# Altium project ANALOG SIGNAL DEV-BOARD.PrjPcb
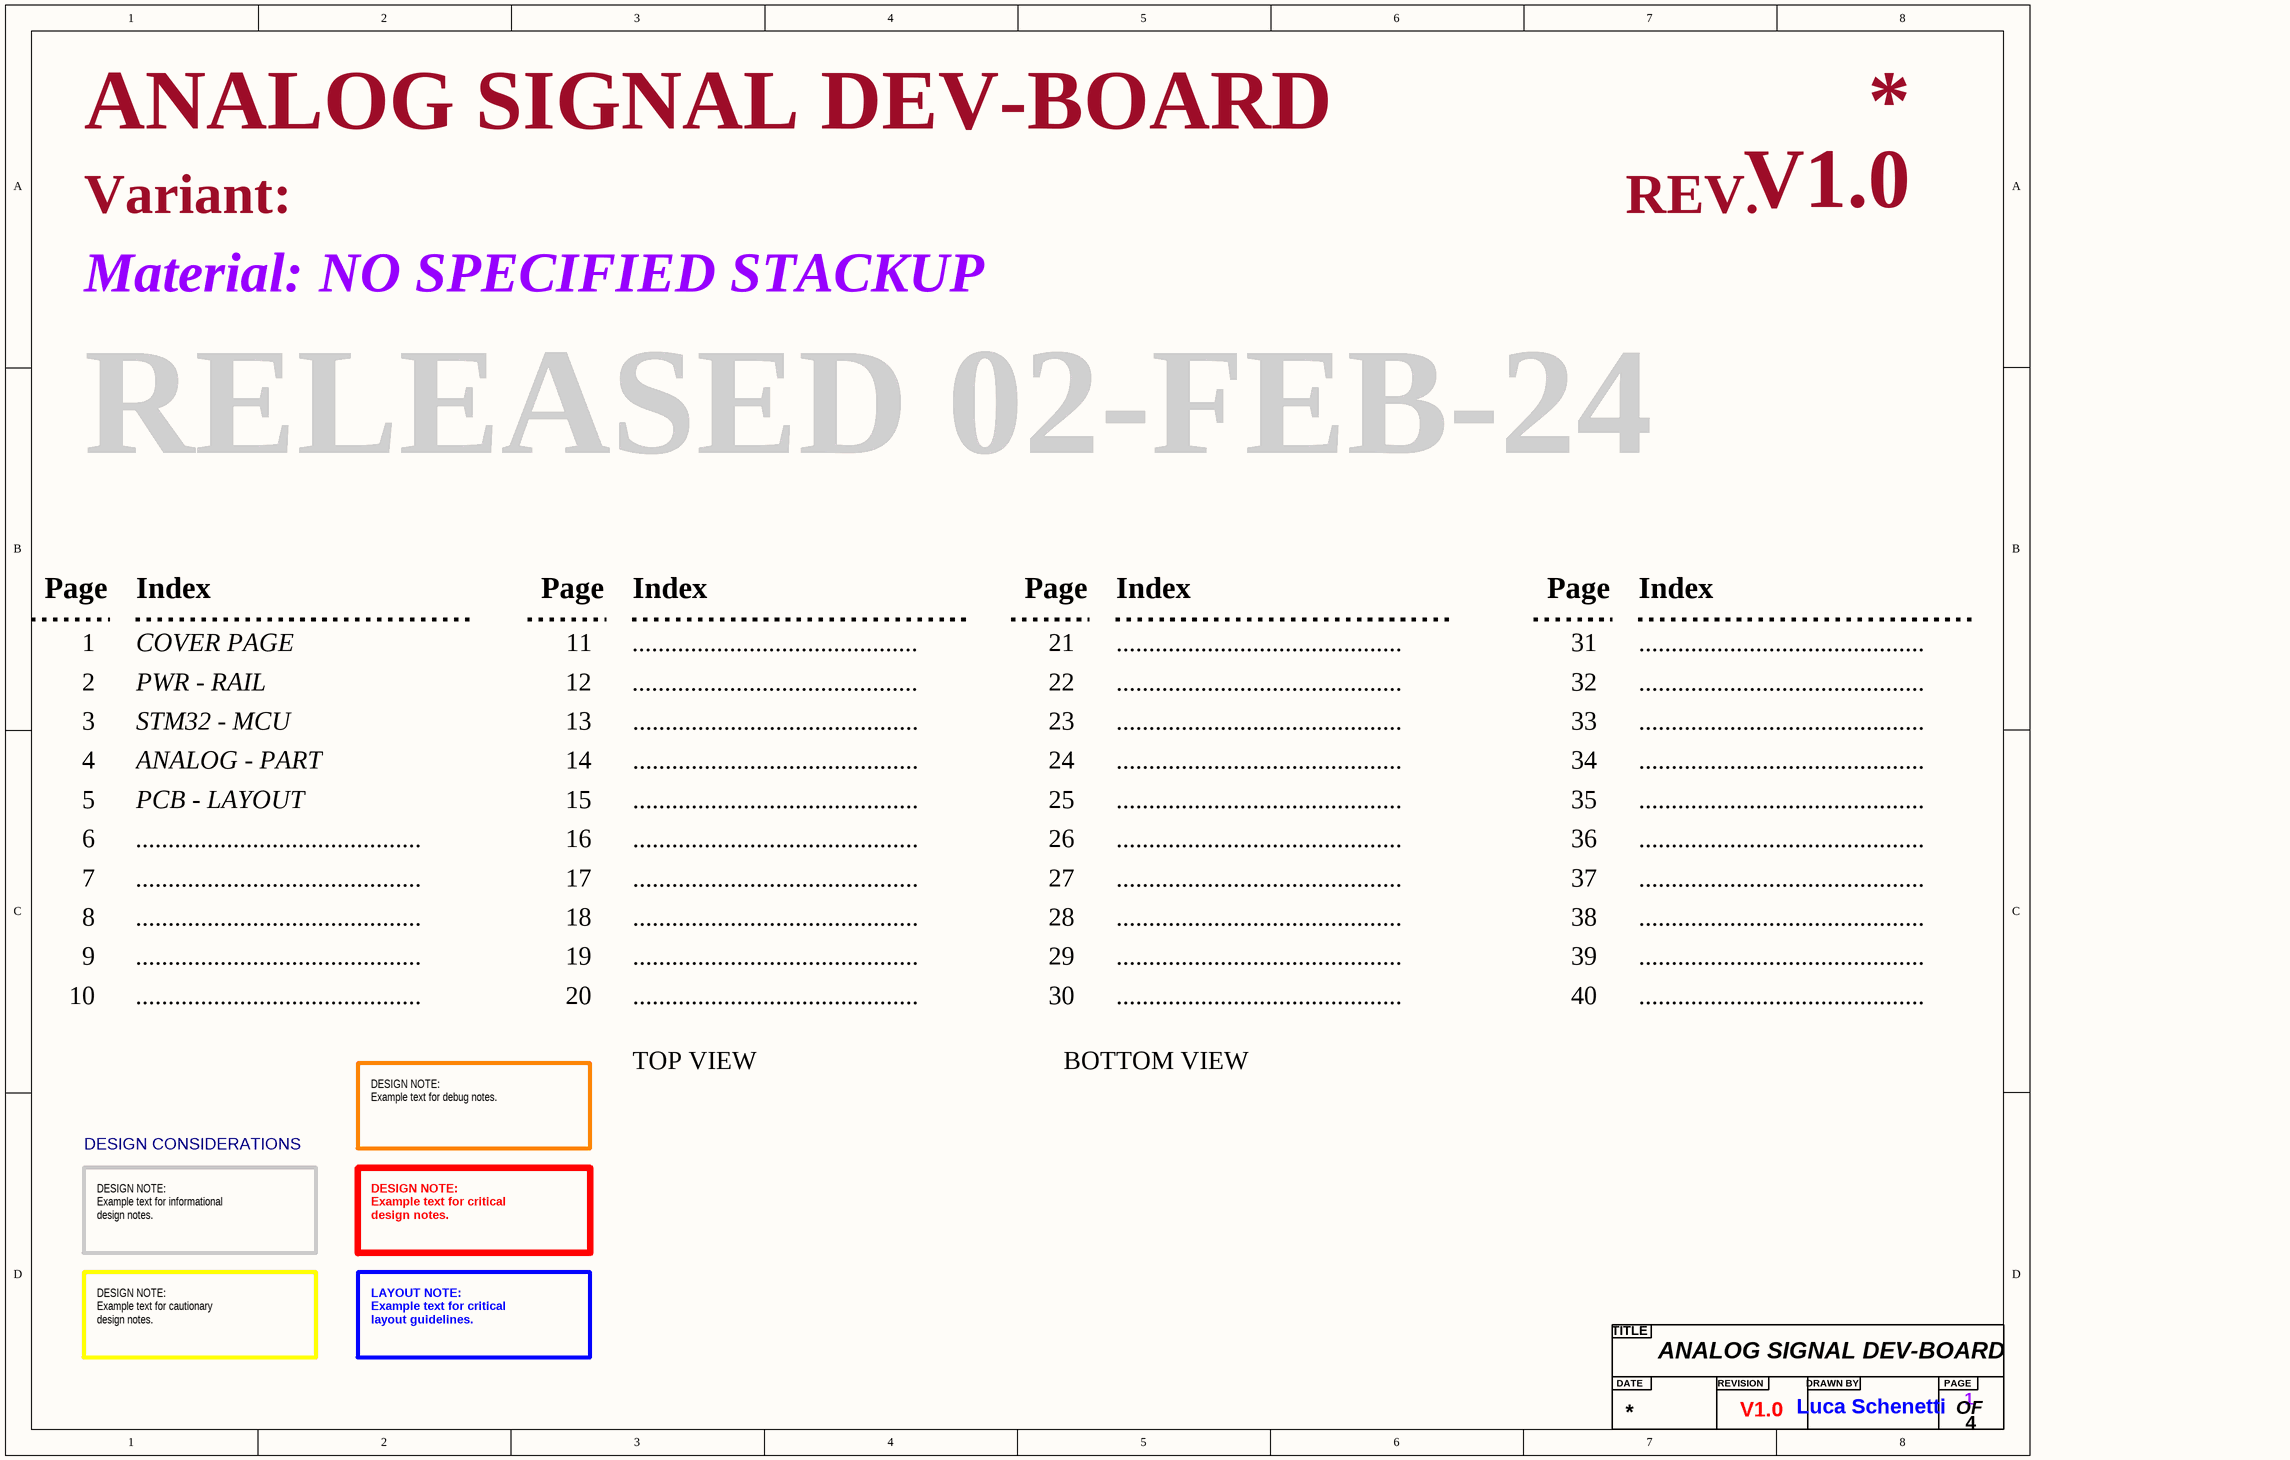
[diagram p0: COVER PAGE.SchDoc]
4 sheets, 282 parts. Net scope: flat (ports and power ports of the same name join across sheets).
Board file: PCB-LAYOUT.PcbDoc
Sheets:
  COVER PAGE.SchDoc
  PWR-RAIL.SchDoc
  STM32-MCU.SchDoc
  ANALOG-PART.SchDoc

## Sheet COVER PAGE.SchDoc: ANALOG SIGNAL DEV-BOARD
size A3; Author: Luca Schenetti; DrawnBy: Luca Schenetti; Engineer: Luca Schenetti; Revision: V1.0; SheetNumber: 1; SheetTotal: 4; Material: NO SPECIFIED STACKUP

### Parts
(Parts that share a designator on the sheet are numbered #1, #2 ... from top to bottom, then left to right.)
?#1  Title  (value not drawn)  (graphical)

### Notes on the sheet
- Variant:
- REV.
- Material:
- RELEASED 02-FEB-24
- Page
- Index
- 1
- 2
- COVER PAGE
- PWR - RAIL
- 11
- 12
- ............................................
- 21
- 22
- 31
- 32
- 3
- STM32 - MCU
- 13
- 23
- 33
- 4
- 5
- ANALOG - PART
- PCB - LAYOUT
- 14
- 15
- 24
- 25
- 34
- 35
- 6
- 7
- 16
- 17
- 26
- 27
- 36
- 37
- 8
- 18
- 28
- 38
- 9
- 10
- 19
- 20
- 29
- 30
- 39
- 40
- TOP VIEW
- BOTTOM VIEW
- DESIGN CONSIDERATIONS
- DESIGN NOTE:
  Example text for debug notes.
- DESIGN NOTE:
  Example text for informational
  design notes.
- DESIGN NOTE:
  Example text for critical
  design notes.
- DESIGN NOTE:
  Example text for cautionary
  design notes.
- LAYOUT NOTE:
  Example text for critical
  layout guidelines.
- (in symbol Title) TITLE; DATE; REVISION; DRAWN BY; PAGE; OF

## Sheet PWR-RAIL.SchDoc: ANALOG SIGNAL DEV-BOARD
size A2; DrawnBy: Luca Schenetti; Revision: V1.0; SheetNumber: 2; SheetTotal: 4
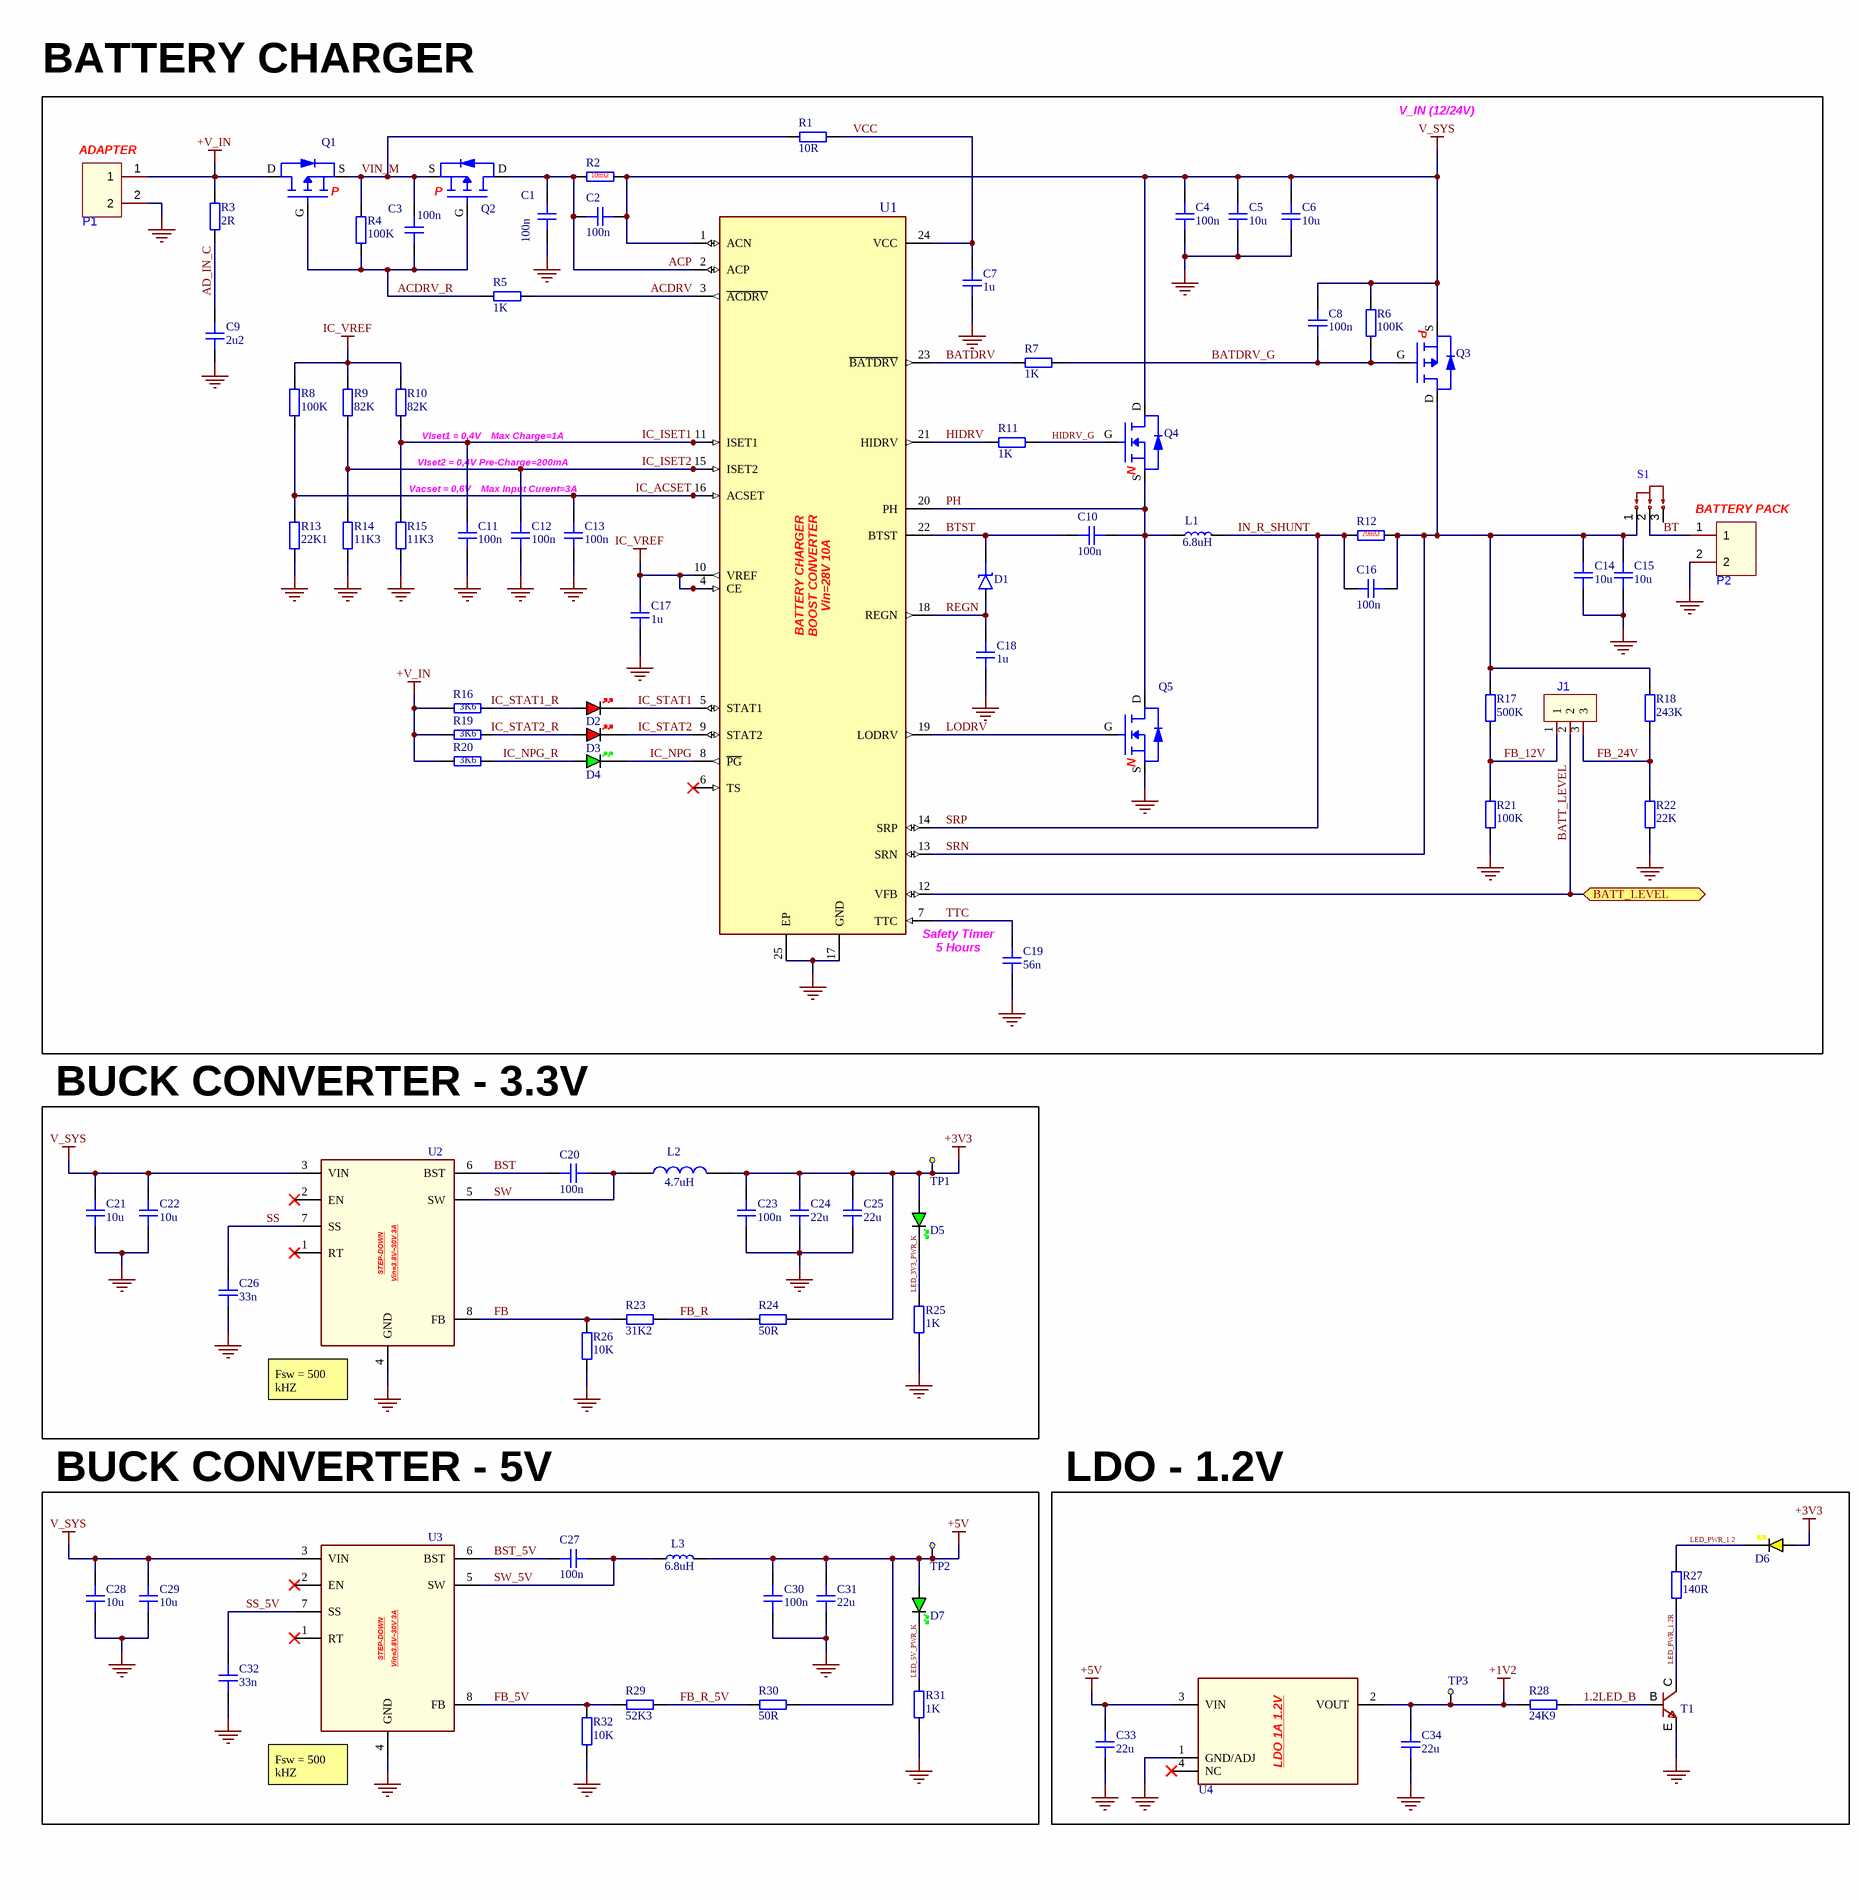
[diagram p1: PWR-RAIL.SchDoc, left]
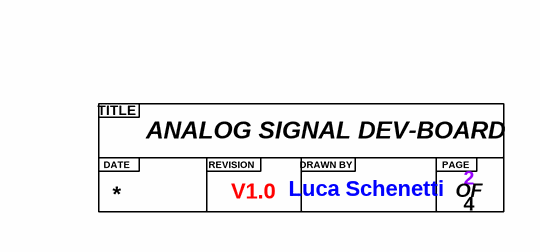
[diagram p2: PWR-RAIL.SchDoc, right]

### Parts
(Parts that share a designator on the sheet are numbered #1, #2 ... from top to bottom, then left to right.)
?#2  Title  (value not drawn)  (graphical)
C1  100n  [CAP_0603]
C2  100n  [CAP_0603]
C3  100n  [CAP_0603]
C4  100n  [CAP_0603]
C5  10u  [CAP_0805]
C6  10u  [CAP_0805]
C7  1u  [CAP_0603]
C8  100n  [CAP_0603]
C9  2u2  [CAP_0603]
C10  100n  [CAP_0603]
C11  100n  [CAP_0603]
C12  100n  [CAP_0603]
C13  100n  [CAP_0603]
C14  10u  [CAP_0805]
C15  10u  [CAP_0805]
C16  100n  [CAP_0603]
C17  1u  [CAP_0603]
C18  1u  [CAP_0603]
C19  56n  [CAP_0603]
C20  100n  [CAP_0603]
C21  10u  [CAP_0805]
C22  10u  [CAP_0805]
C23  100n  [CAP_0603]
C24  22u  [CAP_0603]
C25  22u  [CAP_0603]
C26  33n  [CAP_0603]
C27  100n  [CAP_0603]
C28  10u  [CAP_0805]
C29  10u  [CAP_0805]
C30  100n  [CAP_0603]
C31  22u  [CAP_0603]
C32  33n  [CAP_0603]
C33  22u  [CAP_1206]
C34  22u  [CAP_1206]
D1  Diode Schottky  [RB521S30T1G]  (value not drawn)
D2  RED  [LED_0603_RED]  (value not drawn)
D3  RED  [LED_0603_RED]  (value not drawn)
D4  GREEN  [LED_0603_GREEN]  (value not drawn)
D5  GREEN  [LED_0603_GREEN]  (value not drawn)
D6  YELLOW  [LED_0603_YELLOW]  (value not drawn)
D7  GREEN  [LED_0603_GREEN]  (value not drawn)
J1  2.54mm 3P  [2.54mm 3P]  (value not drawn)
L1  6.8uH  [FXL0530-6R8-M]
L2  4.7uH  [FXL0530-4R7-M]
L3  6.8uH  [SMMS0420-6R8M]
P1  WJ500V-5.08-2P  [CONN-TH_2P-P5.00_WJ500V-5.08-2P]  (value not drawn)
P2  WJ500V-5.08-2P  [CONN-TH_2P-P5.00_WJ500V-5.08-2P]  (value not drawn)
Q1  P-Channel VDS=-30V  [SI7617DN-T1-GE3]  (value not drawn)
Q2  P-Channel VDS=-30V  [SI7617DN-T1-GE3]  (value not drawn)
Q3  P-Channel VDS=-30V  [SI7617DN-T1-GE3]  (value not drawn)
Q4  N-Channel Vgs=30V 12A  [SIS412DN-T1-GE3]  (value not drawn)
Q5  N-Channel Vgs=30V 12A  [SIS412DN-T1-GE3]  (value not drawn)
R1  10R  [RES_1206]
R2  10mΩ  [RES_1206]
R3  2R  [RES_2010]
R4  100K  [RES_0603]
R5  1K  [RES_0603]
R6  100K  [RES_0603]
R7  1K  [RES_0603]
R8  100K  [RES_0603]
R9  82K  [RES_0603]
R10  82K  [RES_0603]
R11  1K  [RES_0603]
R12  20mΩ  [RES_1206]
R13  22K1  [RES_0603]
R14  11K3  [RES_0603]
R15  11K3  [RES_0603]
R16  3K6  [RES_0603]
R17  500K  [RES_0603]
R18  243K  [RES_0603]
R19  3K6  [RES_0603]
R20  3K6  [RES_0603]
R21  100K  [RES_0603]
R22  22K  [RES_0603]
R23  31K2  [RES_0603]
R24  50R  [RES_0603]
R25  1K  [RES_0402]
R26  10K  [RES_0603]
R27  140R  [RES_0402]
R28  24K9  [RES_0402]
R29  52K3  [RES_0603]
R30  50R  [RES_0603]
R31  1K  [RES_0402]
R32  10K  [RES_0603]
S1  3 POS SWITCH LATERAL MOUNT  [HX SS12D10G4-WJ]  (value not drawn)
T1  40V NPN IC = 1A  [MMBT3904]  (value not drawn)
TP1  Test Point  [Test Point]  (value not drawn)
TP2  Test Point  [Test Point]  (value not drawn)
TP3  Test Point  [Test Point]  (value not drawn)
U1  Battery Charger 1S-7S Buck-Boost Converter Li-Ion  [BQ24610RGER]  (value not drawn)
U2  Step Down Converter 3A 3.8V~30V  [TPS62933DRLR]  (value not drawn)
U3  Step Down Converter 3A 3.8V~30V  [TPS62933DRLR]  (value not drawn)
U4  LDO 1A 1.2V  [AMS1117-1.2]  (value not drawn)

### Blocks framed on the sheet
BATTERY CHARGER: C1-C19 D1-D4 J1 L1 P1 P2 Q1-Q5 R1-R22 S1 U1
BUCK CONVERTER - 3.3V: C20-C26 D5 L2 R23-R26 TP1 U2
BUCK CONVERTER - 5V: C27-C32 D7 L3 R29-R32 TP2 U3
LDO - 1.2V: C33 C34 D6 R27 R28 T1 TP3 U4

### Ports
BATT_LEVEL (bidir, see STM32-MCU[3C])

### Nets
+1V2: C34.2 R28.2 TP3.1(Test_Point) U4.2(VOUT)
+3V3: C23.1 C24.2 C25.2 D5.A D6.A L2.2 R24.1 TP1.1(Test_Point)
+5V: C30.1 C31.2 C33.2 D7.A L3.2 R30.1 TP2.1(Test_Point) U4.3(VIN)
+V_IN: P1.1 Q1.D R3.2 R16.1 R19.1 R20.1
GND: C1.2 C4.2 C5.1 C6.1 C7.2 C9.1 C11.1 C12.1 C13.1 C14.1 C15.1 C17.2 C18.2 C19.1 C21.1 C22.1 C23.2 C24.1 C25.1 C26.2 C28.1 C29.1 C30.2 C31.1 C32.2 C33.1 C34.1 P1.2 P2.2 Q5.S R13.1 R14.1 R15.1 R21.2 R22.2 R25.1 R26.1 R31.1 R32.1 T1.E U1.17(GND) U1.25(EP) U2.4(GND) U3.4(GND) U4.1(GND/ADJ)
IC_VREF: C17.1 R8.2 R9.2 R10.2 U1.4(CE) U1.10(VREF)
V_SYS: C2.1 C4.1 C5.2 C6.2 C8.1 C21.2 C22.2 C28.2 C29.2 Q3.S Q4.D R2.2 R6.1 U1.1(ACN) U2.3(VIN) U3.3(VIN)
1.2LED_B: R28.1 T1.B
ACDRV: R5.1 U1.3(~{ACDRV})
ACDRV_R: C3.2 Q1.G Q2.G R4.2 R5.2
ACP: C1.1 C2.2 Q2.D R2.1 U1.2(ACP)
AD_IN_C: C9.2 R3.1
BATDRV: R7.2 U1.23(~{BATDRV})
BATDRV_G: C8.2 Q3.G R6.2 R7.1
BATT_LEVEL: J1.2 U1.12(VFB) ; port BATT_LEVEL
BST: C20.2 U2.6(BST)
BST_5V: C27.2 U3.6(BST)
BT: P2.1 S1.2
BTST: C10.1 D1.K U1.22(BTST)
FB: R23.2 R26.2 U2.8(FB)
FB_5V: R29.2 R32.2 U3.8(FB)
FB_12V: J1.1 R17.2 R21.1
FB_24V: J1.3 R18.2 R22.1
FB_R: R23.1 R24.2
FB_R_5V: R29.1 R30.2
HIDRV: R11.2 U1.21(HIDRV)
HIDRV_G: Q4.G R11.1
IC_ACSET: C13.2 R8.1 R13.2 U1.16(ACSET)
IC_ISET1: C11.2 R10.1 R15.2 U1.11(ISET1)
IC_ISET2: C12.2 R9.1 R14.2 U1.15(ISET2)
IC_NPG: D4.K U1.8(~{PG})
IC_NPG_R: D4.A R20.2
IC_STAT1: D2.K U1.5(STAT1)
IC_STAT1_R: D2.A R16.2
IC_STAT2: D3.K U1.9(STAT2)
IC_STAT2_R: D3.A R19.2
IN_R_SHUNT: C16.1 L1.2 R12.1 U1.14(SRP)  [also labelled SRP]
LED_3V3_PWR_K: D5.K R25.2
LED_5V_PWR_K: D7.K R31.2
LED_PWR_1.2: D6.K R27.2
LED_PWR_1.2R: R27.1 T1.C
LODRV: Q5.G U1.19(LODRV)
PH: C10.2 L1.1 Q4.S Q5.D U1.20(PH)
REGN: C18.1 D1.A U1.18(REGN)
SRN: C14.2 C15.2 C16.2 Q3.D R12.2 R17.1 R18.1 S1.1 U1.13(SRN)
SS: C26.1 U2.7(SS)
SS_5V: C32.1 U3.7(SS)
SW: C20.1 L2.1 U2.5(SW)
SW_5V: C27.1 L3.1 U3.5(SW)
TTC: C19.2 U1.7(TTC)
VCC: C7.1 R1.2 U1.24(VCC)
VIN_M: C3.1 Q1.S Q2.S R1.1 R4.1

Not connected (* = marked no-connect by the designer): S1 3; U1 6(TS)*; U2 1(RT)* 2(EN)*; U3 1(RT)* 2(EN)*; U4 4(NC)*

### Notes on the sheet
- (near P1) ADAPTER
- V_IN (12/24V)
- (near R10) VIset1 = 0,4V    Max Charge=1A
- VIset2 = 0,4V Pre-Charge=200mA
- Vacset = 0,6V    Max Input Curent=3A
- (near P2) BATTERY PACK
- Safety Timer
- 5 Hours
- (near U2) Fsw = 500 kHZ
- (near U3) Fsw = 500 kHZ
- (in symbol BQ24610RGER) BATTERY CHARGER; BOOST CONVERTER; Vin=28V 10A
- (in symbol SI7617DN-T1-GE3) P
- (in symbol SIS412DN-T1-GE3) N
- (in symbol Title) TITLE; DATE; REVISION; DRAWN BY; PAGE; OF
- (in symbol TPS62933DRLR) STEP-DOWN; Vin=3.8V~30V 3A

### Library data of the parts
C1-C4 C8 C10-C13 C16 C20 C23 C27 C30 = CAP_0603: Capacitor SMD 0603 [C14663]; Manufacturer: *; Manufacturer Part Number: *; Distributor Link: *; LCSC: *; Rating: *; Dielectric: *
C5 C6 C14 C15 C21 C22 C28 C29 = CAP_0805: Capacitor SMD 0805[C440198]; Manufacturer: *; Manufacturer Part Number: *; Distributor Link: *; LCSC: *; Rating: *; Dielectric: *
C7 C17 C18 = CAP_0603: Capacitor SMD 0603 [C15849]; Manufacturer: *; Manufacturer Part Number: *; Distributor Link: *; LCSC: *; Rating: *; Dielectric: *
C9 = CAP_0603: [C913904]; Manufacturer: *; Manufacturer Part Number: *; Distributor Link: *; LCSC: *; Rating: *; Dielectric: *
C19 = CAP_0603: [C282072]; Manufacturer: *; Manufacturer Part Number: *; Distributor Link: *; LCSC: *; Rating: *; Dielectric: *
C24 C25 C31 = CAP_0603: Capacitor SMD 0603 [C60077]; Manufacturer: *; Manufacturer Part Number: *; Distributor Link: *; LCSC: *; Rating: *; Dielectric: *
C26 C32 = CAP_0603: [C21117]; Manufacturer: *; Manufacturer Part Number: *; Distributor Link: *; LCSC: *; Rating: *; Dielectric: *
C33 C34 = CAP_1206: [C12891]; Manufacturer: *; Manufacturer Part Number: *; Distributor Link: *; LCSC: *; Rating: *; Dielectric: *
D1 = RB521S30T1G: [C145179]
D2 D3 = LED_0603_RED: [C2926776]
D4 = LED_0603_GREEN: [C2986059]
D5 D7 = LED_0603_GREEN: LED 0603 GREEN SMD[C2986059]
D6 = LED_0603_YELLOW: LED 0603 YELLOW SMD[C72038]
J1 = 2.54mm 3P: [C6332196]; Manufacturer: HANBO(汉博); Symbol: HB-PH3-25413PB2GOP; Add into BOM: yes; Pin Structure: 1x3P; Circluar Pins/Square Pins: Square Pins; Current Rating (Max): 3A; Voltage Rating (Max): 250V; Soldering Temperature(Max): 260℃; Device: HB-PH3-25413PB2GOP; LCSC Part Name: 间距:2.54mm 1x3P 直插 方针; Supplier Part: C6332196; Manufacturer Part: HB-PH3-25413PB2GOP; Supplier Footprint: 插件,P=2.54mm; JLCPCB Part Class: Extended Part; Datasheet: https://atta.szlcsc.com/upload/public/pdf/source/20230803/F72D259687963761DF1B552F3BB84A31.pdf; Supplier: LCSC; Convert to PCB: yes; Pitch: 2.54mm; Row Spacing: 2.54mm; Mounting Type: Straight; Number of Rows: Plugin; Number of Pins: 3P; Length of Mating Pin: 6mm; Insulation Height: 2.54mm; Length of End Connection Pin: 3mm; Contact Plating: Gold; Operating Temperature Range: -40℃~+105℃; Color: Black
L1 = FXL0530-6R8-M: [C177249]
L2 = FXL0530-4R7-M: [C177246]
L3 = SMMS0420-6R8M: [C133194]
P1 P2 = WJ500V-5.08-2P: [C8465]; Manufacturer: KANGNEX(康奈克斯电气); Symbol: WJ500V-5.08-2P-14-00A; Add into BOM: yes; Structure: 1x2P; Pitch: 5.08mm; Current Rating (Max): 18A; Voltage Rating (Max): 250V; Wire Gauge - AWG: 14~30; Wire Gauge - mm2: 2.5; Number of PINs Per Row: 2; Screw Specification: M2.5; Device: WJ500V-5.08-2P; LCSC Part Name: 1x2P 5.08mm 直插 排数:1 每排P数:2; Supplier Part: C8465; Manufacturer Part: WJ500V-5.08-2P; Supplier Footprint: 插件,P=5.08mm; JLCPCB Part Class: Extended Part; Datasheet: https://atta.szlcsc.com/upload/public/pdf/source/20191225/C8465_02D34CE5B5B4A53DF5891601D97FA9F4.pdf; Supplier: LCSC; Convert to PCB: yes; Color: Green; Mounting Style: Straight; Number of Pins: 2P; Number of Rows: 1; Contact Material: -; Contact Plating: -; Operating Temperature Range: -40℃~+105℃; Soldering Temperature(Max): -
Q1-Q3 = SI7617DN-T1-GE3: [C727607]
Q4 Q5 = SIS412DN-T1-GE3: [C111309]
R1 = RES_1206: [C17903]; Manufacturer: *; Manufacturer Part Number: *; Distributor Link: *; LCSC: *
R2 = RES_1206: [C105362]; Manufacturer: *; Manufacturer Part Number: *; Distributor Link: *; LCSC: *
R3 = RES_2010: [C2960923]
R4 R6 R8 R21 = RES_0603: [C25803]; Manufacturer: *; Manufacturer Part Number: *; Distributor Link: *; LCSC: *
R5 R7 R11 = RES_0603: [C21190]; Manufacturer: *; Manufacturer Part Number: *; Distributor Link: *; LCSC: *
R9 R10 = RES_0603: [C23254]; Manufacturer: *; Manufacturer Part Number: *; Distributor Link: *; LCSC: *
R12 = RES_1206: [C7420010]; Manufacturer: *; Manufacturer Part Number: *; Distributor Link: *; LCSC: *
R13 = RES_0603: [C25961]; Manufacturer: *; Manufacturer Part Number: *; Distributor Link: *; LCSC: *
R14 R15 = RES_0603: [C22860]; Manufacturer: *; Manufacturer Part Number: *; Distributor Link: *; LCSC: *
R16 R19 R20 = RES_0603: [C22980]; Manufacturer: *; Manufacturer Part Number: *; Distributor Link: *; LCSC: *
R17 = RES_0603: [C2902631]; Manufacturer: *; Manufacturer Part Number: *; Distributor Link: *; LCSC: *
R18 = RES_0603: [C23351]; Manufacturer: *; Manufacturer Part Number: *; Distributor Link: *; LCSC: *
R22 = RES_0603: [C31850]; Manufacturer: *; Manufacturer Part Number: *; Distributor Link: *; LCSC: *
R23 = RES_0603: [C863036]; Manufacturer: *; Manufacturer Part Number: *; Distributor Link: *; LCSC: *
R24 R30 = RES_0603: [C849792]; Manufacturer: *; Manufacturer Part Number: *; Distributor Link: *; LCSC: *
R25 R31 = RES_0402: Resistor SMD 0402 [C11702]; Manufacturer: *; Manufacturer Part Number: *; Distributor Link: *; LCSC: *
R26 R32 = RES_0603: [C25804]; Manufacturer: *; Manufacturer Part Number: *; Distributor Link: *; LCSC: *
R27 = RES_0402: [C138056]; Manufacturer: *; Manufacturer Part Number: *; Distributor Link: *; LCSC: *
R28 = RES_0402: [C25874]; Manufacturer: *; Manufacturer Part Number: *; Distributor Link: *; LCSC: *
R29 = RES_0603: [C23198]; Manufacturer: *; Manufacturer Part Number: *; Distributor Link: *; LCSC: *
S1 = HX SS12D10G4-WJ: [C19189123]; Manufacturer: hanxia(韩下); Add into BOM: yes; Circuit: SPDT; Switch Length: 12.7mm; Switch Width: 6.7mm; Switch Height: 6.4mm; Current Rating (DC): 2A; Voltage Rating (DC): 125V; Mechanical Life: 3千次; Symbol: HX SS12D10G4-WJ; Device: HX SS12D10G4-WJ; LCSC Part Name: 两档卧式插件 3脚拨动开关弯插 柄长4.0mm; Supplier Part: C19189123; Manufacturer Part: HX SS12D10G4-WJ; Supplier Footprint: 插件-3P,6.7x12.7mm; JLCPCB Part Class: Extended Part; Datasheet: https://atta.szlcsc.com/upload/public/pdf/source/20231103/079DBC80FFF3B72C7ED19D92AC75D426.pdf; Supplier: LCSC; Convert to PCB: yes; Operating Temperature: -25℃~+70℃
T1 = MMBT3904: [C20526]
U1 = BQ24610RGER: [C19384]
U2 U3 = TPS62933DRLR: [C3200405]
U4 = AMS1117-1.2: [C347218]
TP1-TP3 = Test Point: Value: Test Point

## Sheet STM32-MCU.SchDoc: ANALOG SIGNAL DEV-BOARD
size A1; DrawnBy: Luca Schenetti; Revision: V1.0; SheetNumber: 3; SheetTotal: 4
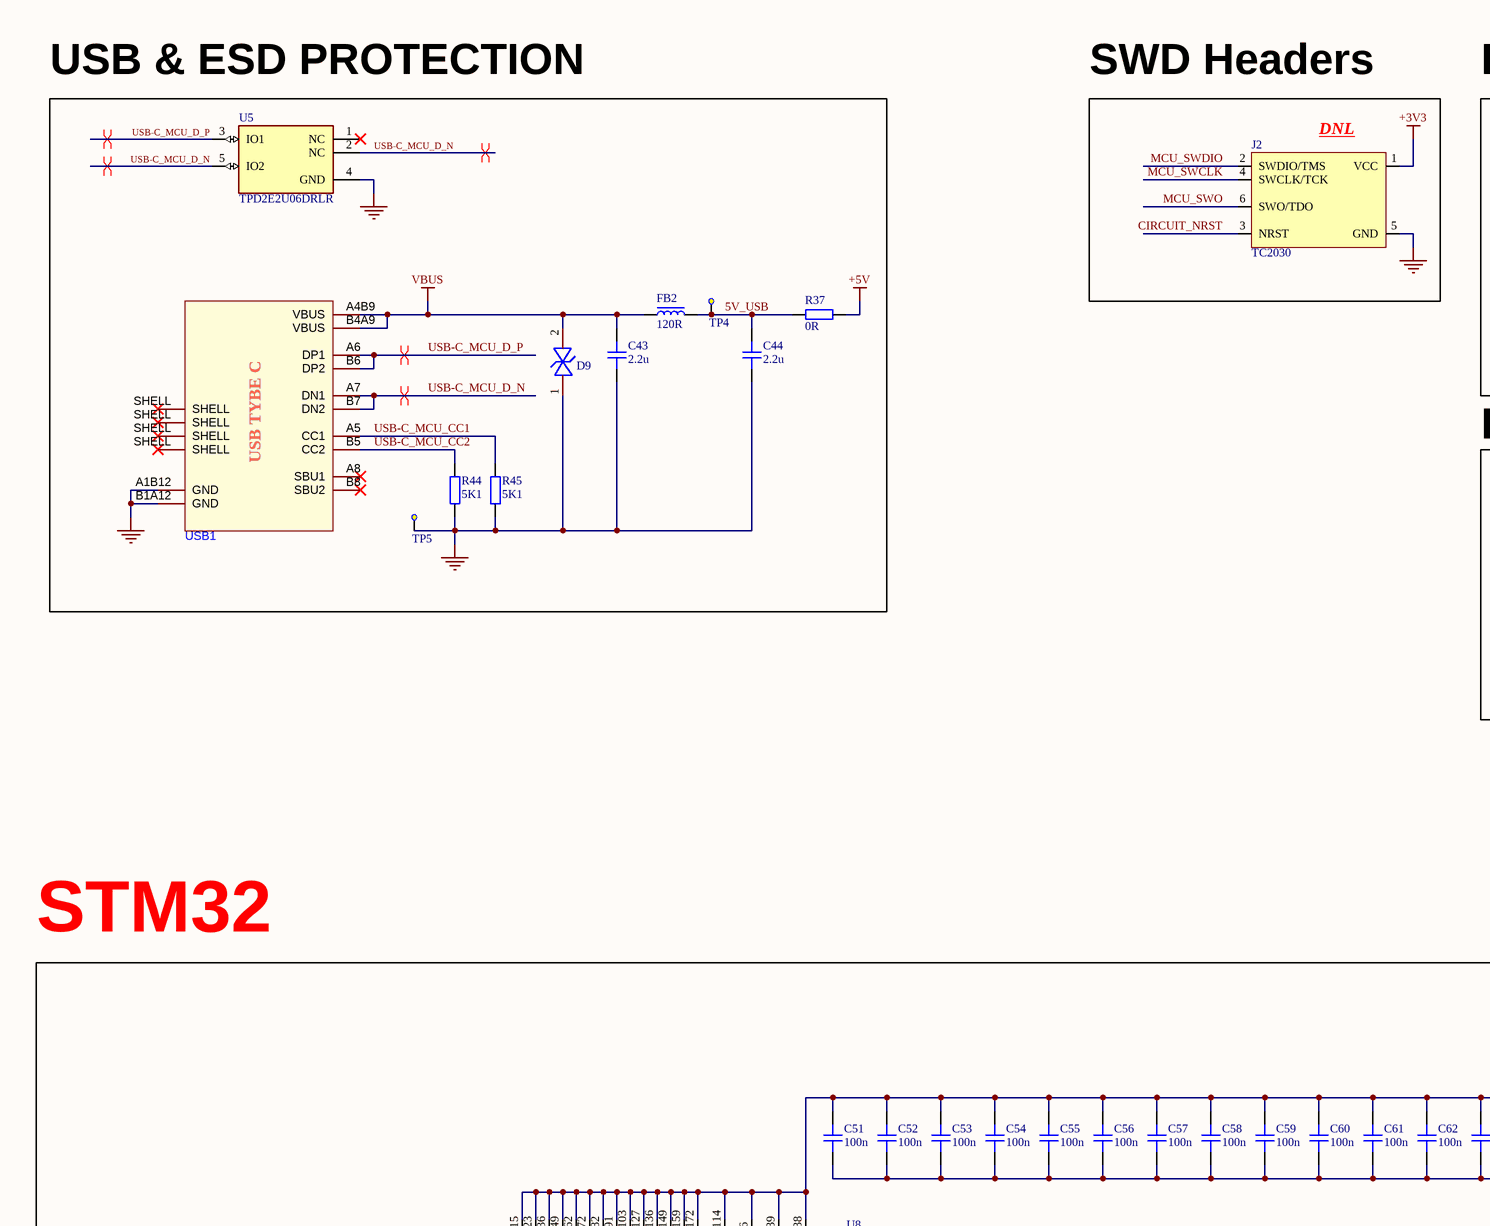
[diagram p3: STM32-MCU.SchDoc, top left]
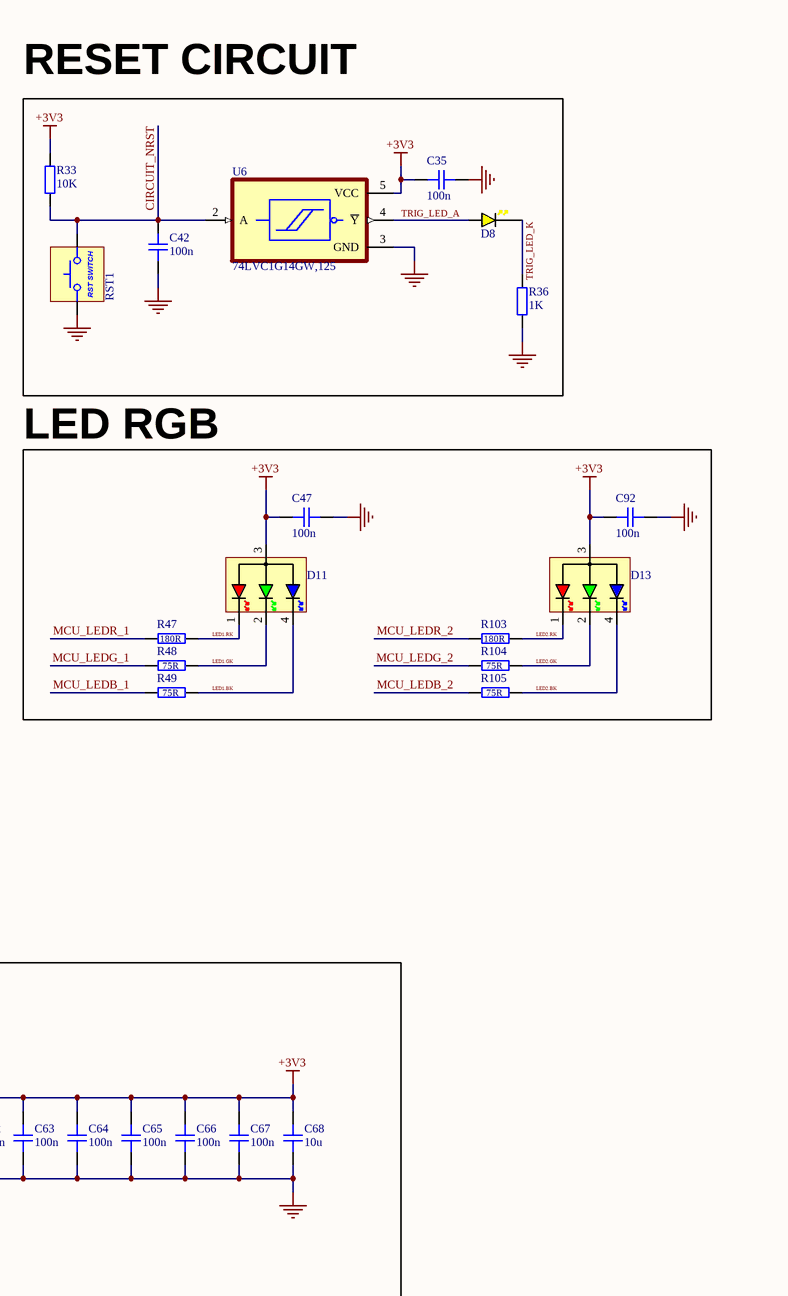
[diagram p4: STM32-MCU.SchDoc, top middle]
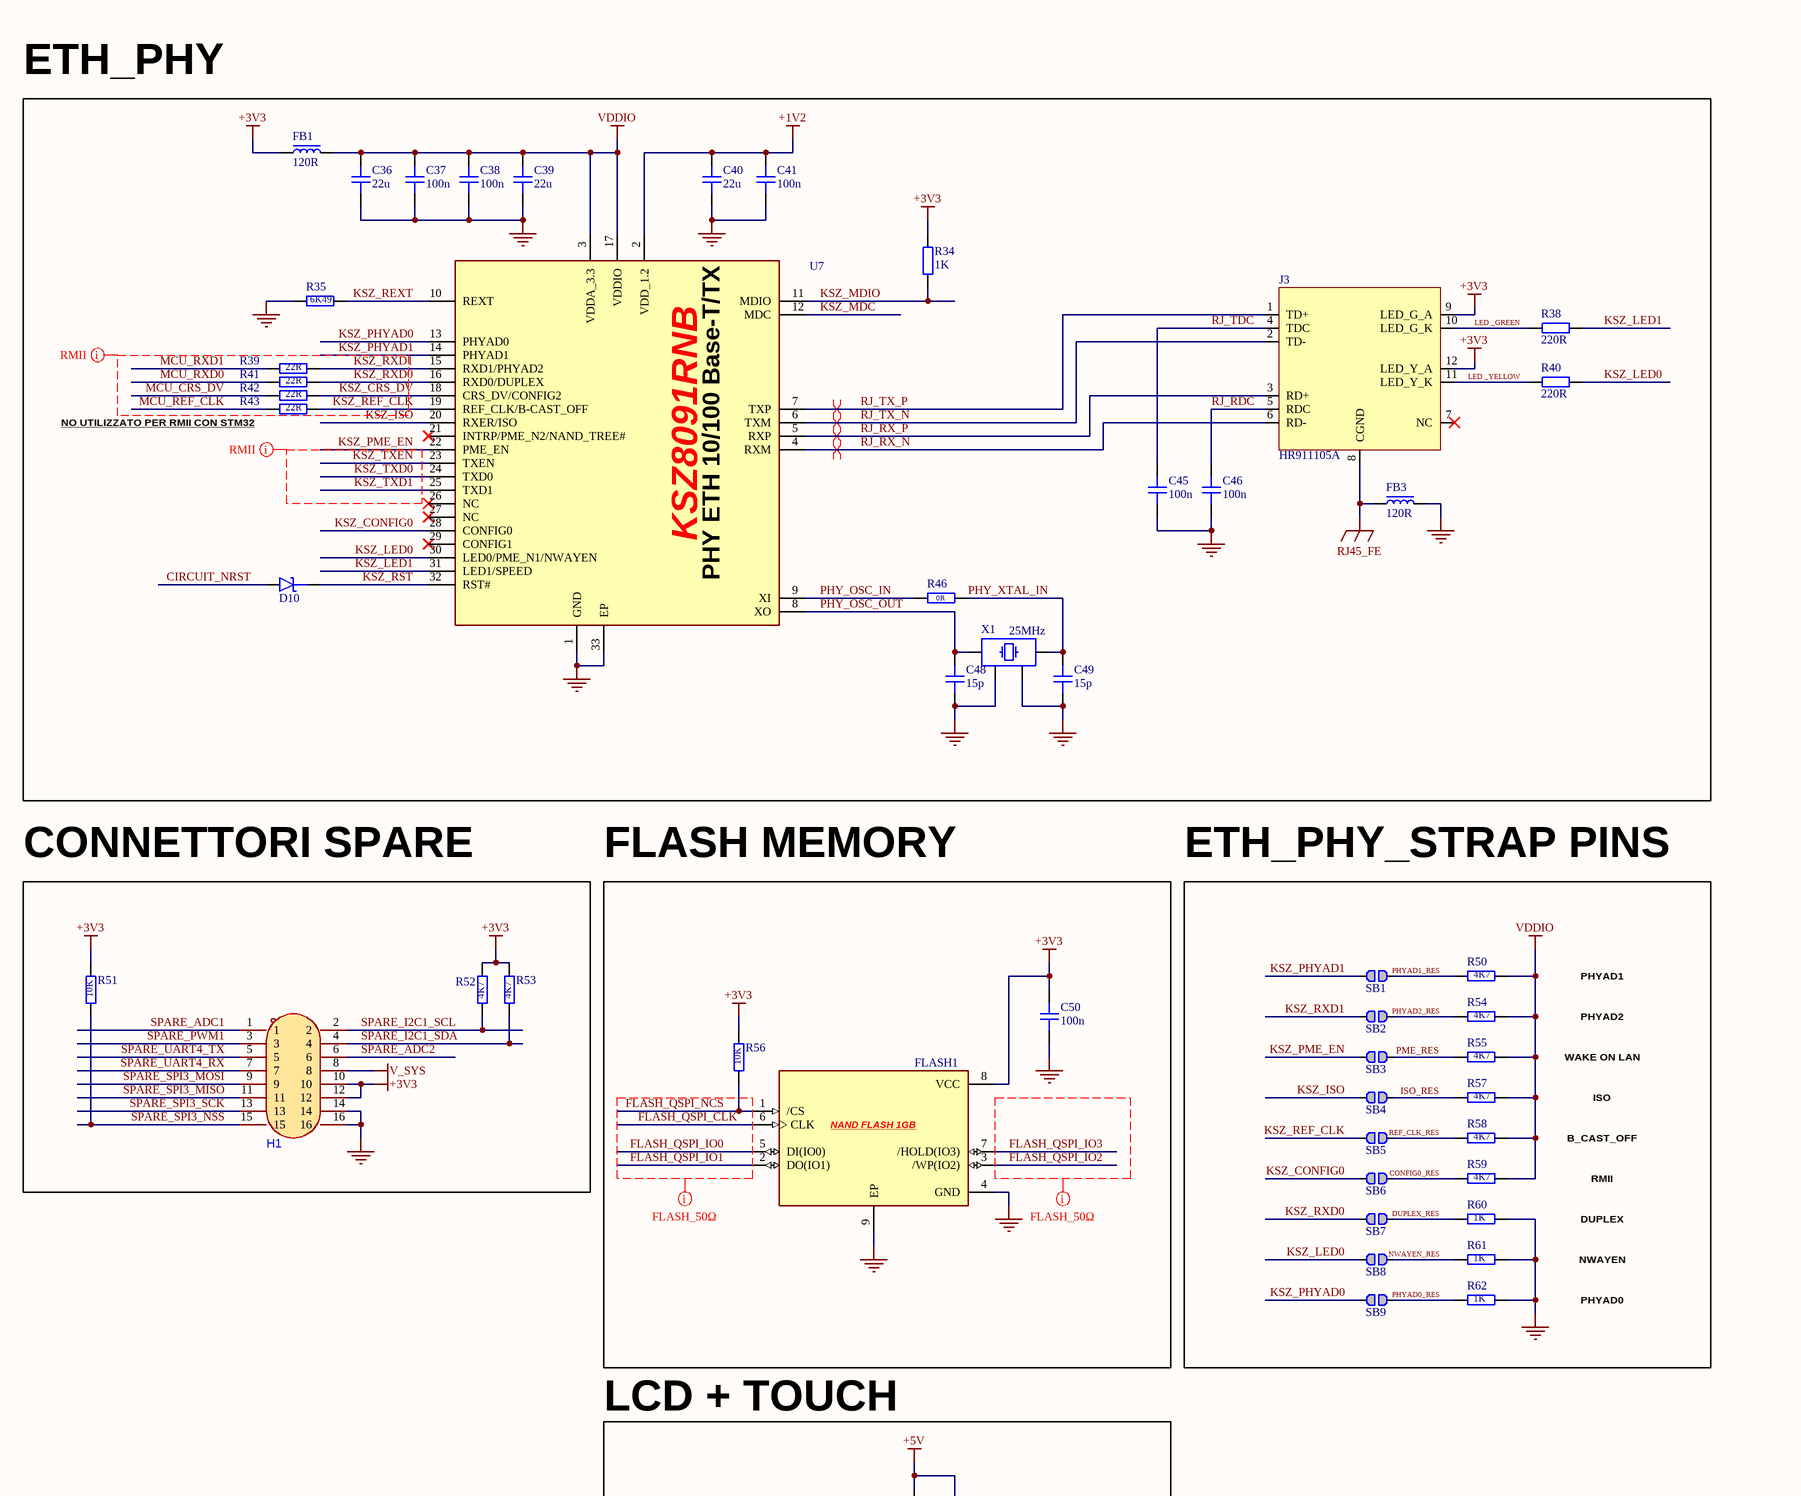
[diagram p5: STM32-MCU.SchDoc, top right]
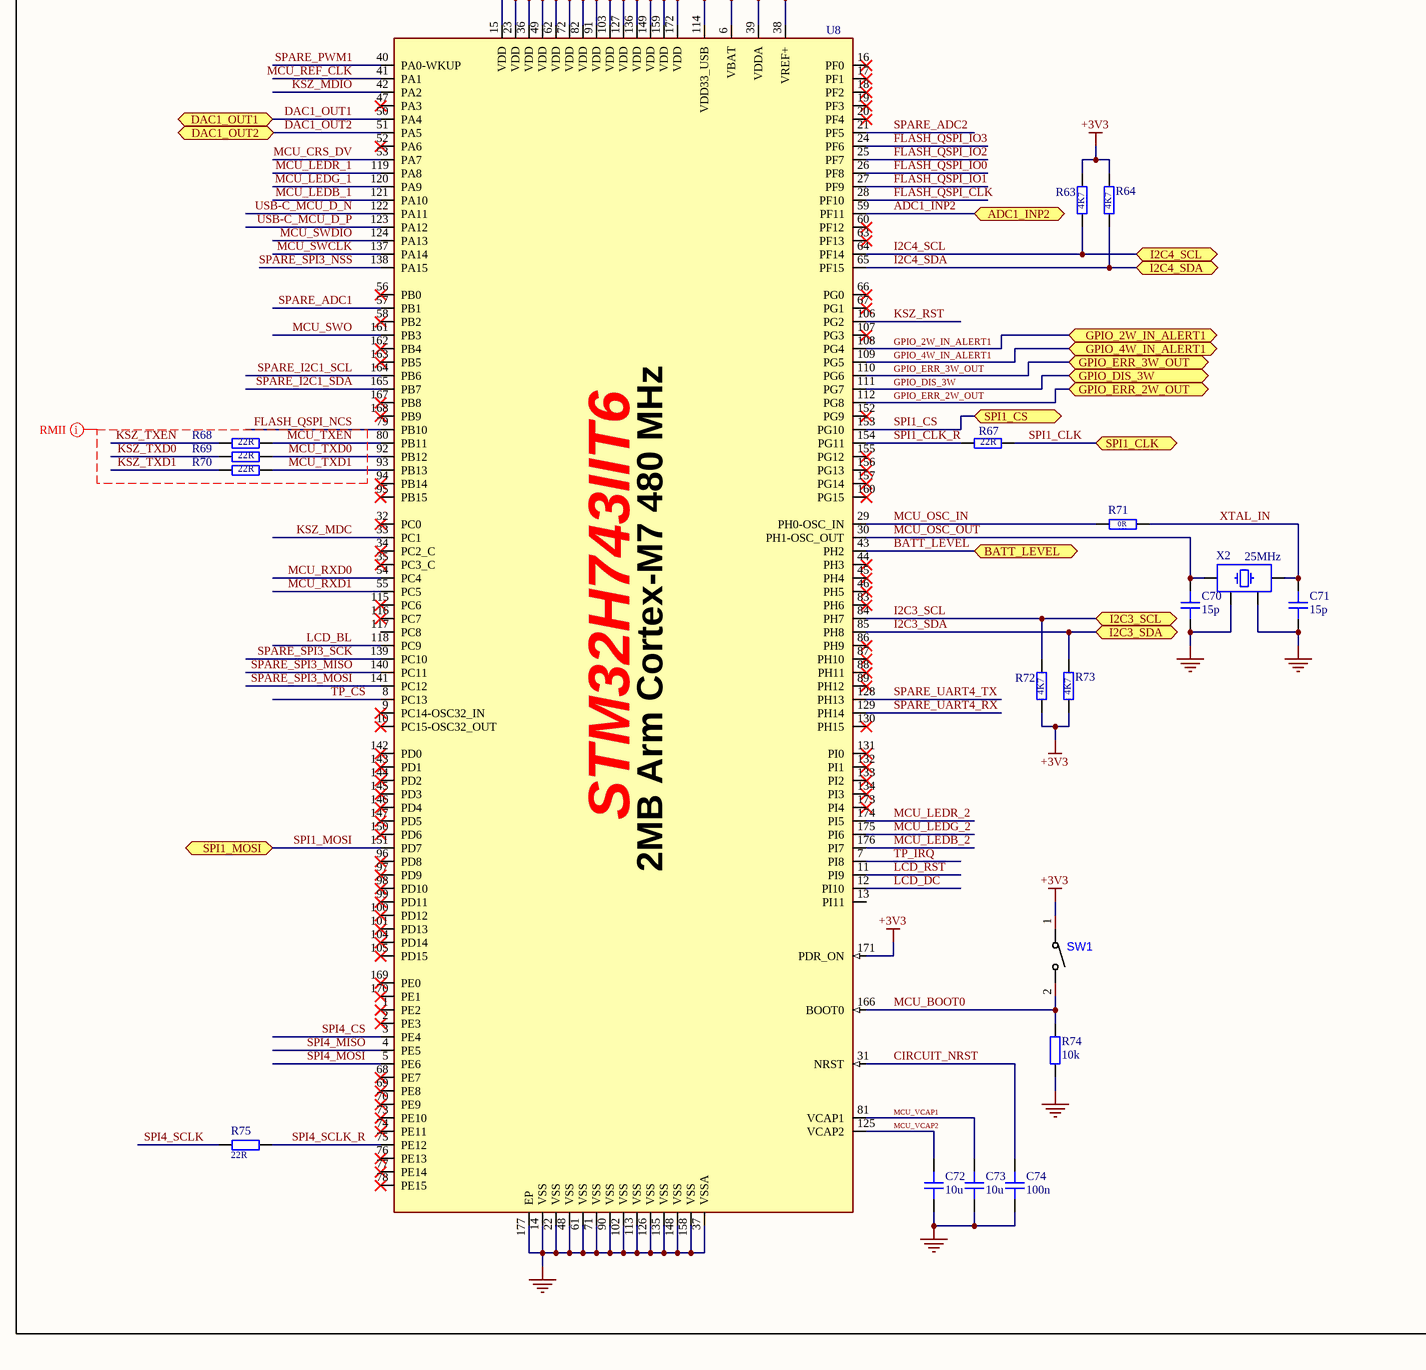
[diagram p6: STM32-MCU.SchDoc, bottom left]
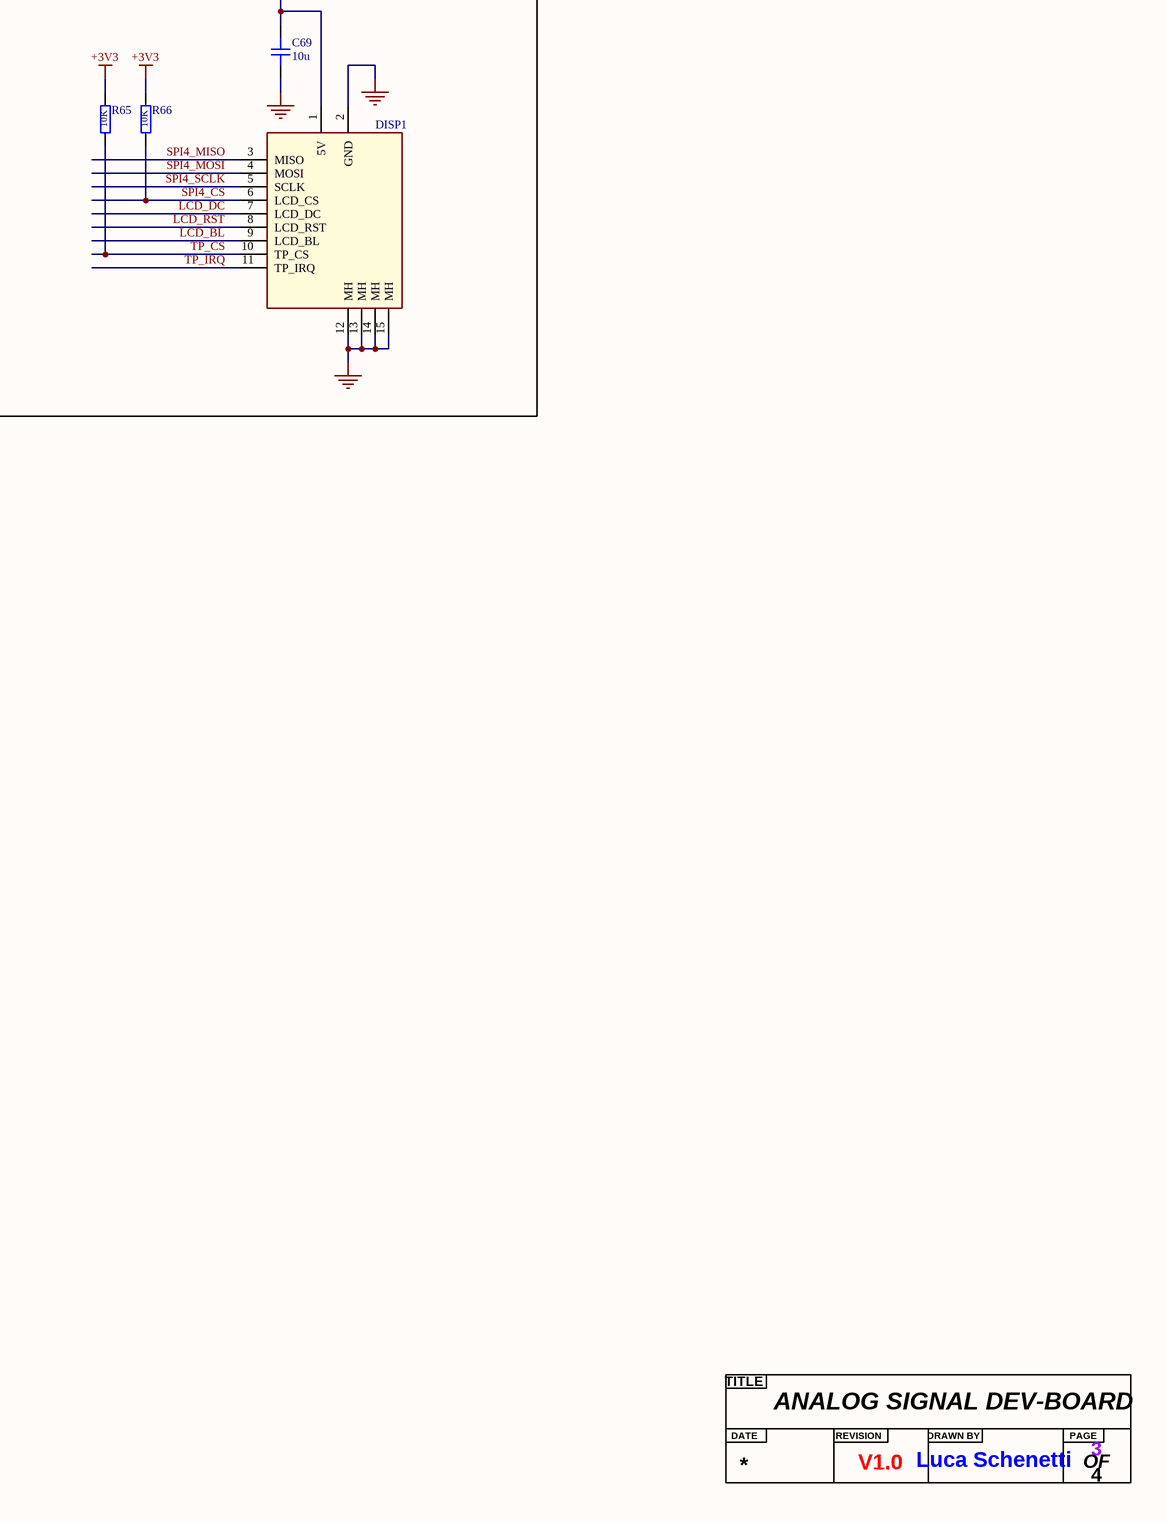
[diagram p7: STM32-MCU.SchDoc, bottom right]

### Parts
(Parts that share a designator on the sheet are numbered #1, #2 ... from top to bottom, then left to right.)
?#3  Title  (value not drawn)  (graphical)
C35  100n  [CAP_0402]
C36  22u  [CAP_0603]
C37  100n  [CAP_0603]
C38  100n  [CAP_0603]
C39  22u  [CAP_0603]
C40  22u  [CAP_0603]
C41  100n  [CAP_0603]
C42  100n  [CAP_0402]
C43  2.2u  [CAP_0603]
C44  2.2u  [CAP_0603]
C45  100n  [CAP_0603]
C46  100n  [CAP_0603]
C47  100n  [CAP_0402]
C48  15p  [CAP_0402]
C49  15p  [CAP_0402]
C50  100n  [CAP_0603]
C51  100n  [CAP_0603]
C52  100n  [CAP_0603]
C53  100n  [CAP_0603]
C54  100n  [CAP_0603]
C55  100n  [CAP_0603]
C56  100n  [CAP_0603]
C57  100n  [CAP_0603]
C58  100n  [CAP_0603]
C59  100n  [CAP_0603]
C60  100n  [CAP_0603]
C61  100n  [CAP_0603]
C62  100n  [CAP_0603]
C63  100n  [CAP_0603]
C64  100n  [CAP_0603]
C65  100n  [CAP_0603]
C66  100n  [CAP_0603]
C67  100n  [CAP_0603]
C68  10u  [CAP_0805]
C69  10u  [CAP_0603]
C70  15p  [CAP_0402]
C71  15p  [CAP_0402]
C72  10u  [CAP_0805]
C73  10u  [CAP_0805]
C74  100n  [CAP_0603]
C92  100n  [CAP_0402]
D8  YELLOW  [LED_0603_YELLOW]  (value not drawn)
D9  ESD Protection TVS 6.0V  [SMF6.0CA]  (value not drawn)
D10  Diode Schottky  [RB521S30T1G]  (value not drawn)
D11  RGB_LED  [XL-2012RGBC]  (value not drawn)
D13  RGB_LED  [XL-2012RGBC]  (value not drawn)
DISP1  https://www.waveshare.com/product/displays/lcd-oled/lcd-oled-2/2.8inch-resistive-touch-lcd.htm  [LCD 2.8 INCH TOUCH]  (value not drawn)
FB1  120R  [FB_0603]
FB2  120R  [FB_0603]
FB3  120R  [FB_0603]
FLASH1  FALSH NAND 1GB  [W25N01GVZEIG]  (value not drawn)
H1  16P 2.54mm_Female  [16P 2.54mm - Female]  (value not drawn)
J2  TC2030  [TC2030-FP]  (no BOM)
J3  HR911105A  [HR911105A]
R33  10K  [RES_0402]
R34  1K  [RES_0603]
R35  6K49  [RES_0603]
R36  1K  [RES_0402]
R37  0R  [RES_0603]
R38  220R  [RES_0603]
R39  22R  [RES_0402]
R40  220R  [RES_0603]
R41  22R  [RES_0402]
R42  22R  [RES_0402]
R43  22R  [RES_0402]
R44  5K1  [RES_0603]
R45  5K1  [RES_0603]
R46  0R  [RES_0402]
R47  180R  [RES_0603]
R48  75R  [RES_0603]
R49  75R  [RES_0603]
R50  4K7  [RES_0603]
R51  10K  [RES_0603]
R52  4K7  [RES_0603]
R53  4K7  [RES_0603]
R54  4K7  [RES_0603]
R55  4K7  [RES_0603]
R56  10K  [RES_0603]
R57  4K7  [RES_0603]
R58  4K7  [RES_0603]
R59  4K7  [RES_0603]
R60  1K  [RES_0603]
R61  1K  [RES_0603]
R62  1K  [RES_0603]
R63  4K7  [RES_0603]
R64  4K7  [RES_0603]
R65  10K  [RES_0603]
R66  10K  [RES_0603]
R67  22R  [RES_0402]
R68  22R  [RES_0402]
R69  22R  [RES_0402]
R70  22R  [RES_0402]
R71  0R  [RES_0402]
R72  4K7  [RES_0603]
R73  4K7  [RES_0603]
R74  10k  [RES_0603]
R75  22R  [RES_0402]
R103  180R  [RES_0603]
R104  75R  [RES_0603]
R105  75R  [RES_0603]
RST1  RST_SWITCH_STM32  [RST_SWITCH]  (value not drawn)
SB1  Solderbridge  [Solderbridge]  (value not drawn)  (no BOM)
SB2  Solderbridge  [Solderbridge]  (value not drawn)  (no BOM)
SB3  Solderbridge  [Solderbridge]  (value not drawn)  (no BOM)
SB4  Solderbridge  [Solderbridge]  (value not drawn)  (no BOM)
SB5  Solderbridge  [Solderbridge]  (value not drawn)  (no BOM)
SB6  Solderbridge  [Solderbridge]  (value not drawn)  (no BOM)
SB7  Solderbridge  [Solderbridge]  (value not drawn)  (no BOM)
SB8  Solderbridge  [Solderbridge]  (value not drawn)  (no BOM)
SB9  Solderbridge  [Solderbridge]  (value not drawn)  (no BOM)
SW1  TS-1088-AR02016  [TS-1088-AR02016]  (value not drawn)
TP4  Test Point  [Test Point]  (value not drawn)
TP5  Test Point  [Test Point]  (value not drawn)
U5  TPD2E2U06DRLR  [FP-DRL0005A-MFG]
U6  74LVC1G14GW,125  [SOT65P212X110-5N]
U7  ETH PHY 10/100 Base-T/TX  [KSZ8091RNBIA-TR]  (value not drawn)
U8  ARM Cortex M7 32bit MCU 480MHz 2MB Flash 1MB RAM  [STM32H743IIT6]  (value not drawn)
USB1  USB-C CONNECTOR  [USB-3.1-SMD_U262-161N-4BVC11]  (value not drawn)
X1  25MHz  [XTAL_3225]
X2  25MHz  [XTAL_3225]

### Blocks framed on the sheet
USB & ESD PROTECTION: C43 C44 D9 FB2 R37 R44 R45 TP4 TP5 U5 USB1
SWD Headers: J2
RESET CIRCUIT: C35 C42 D8 R33 R36 RST1 U6
ETH_PHY: C36-C41 C45 C46 C48 C49 D10 FB1 FB3 J3 R34 R35 R38-R43 R46 U7 X1
LED RGB: C47 C92 D11 D13 R47-R49 R103-R105
CONNETTORI SPARE: H1 R51-R53
ETH_PHY_STRAP PINS: R50 R54 R55 R57-R62 SB1-SB9
STM32: C51-C68 C70-C74 R63 R64 R67-R75 SW1 U8 X2
LCD + TOUCH: C69 DISP1 R65 R66

### Ports
ADC1_INP2 (bidir, see ANALOG-PART[6B]), BATT_LEVEL (bidir, see PWR-RAIL[5B]), DAC1_OUT1 (bidir, see ANALOG-PART[1A]), DAC1_OUT2 (bidir, see ANALOG-PART[1C]), GPIO_2W_IN_ALERT1 (bidir, see ANALOG-PART[4A]), GPIO_4W_IN_ALERT1 (bidir, see ANALOG-PART[4C]), GPIO_DIS_3W (bidir, see ANALOG-PART[3B]), GPIO_ERR_2W_OUT (bidir, see ANALOG-PART[1A]), GPIO_ERR_3W_OUT (bidir, see ANALOG-PART[3B]), I2C3_SCL (bidir, see ANALOG-PART[4A]), I2C3_SDA (bidir, see ANALOG-PART[4A]), I2C4_SCL (bidir, see ANALOG-PART[4C]), I2C4_SDA (bidir, see ANALOG-PART[4C]), SPI1_CLK (bidir, see ANALOG-PART[5D]), SPI1_CS (bidir, see ANALOG-PART[5D]), SPI1_MOSI (bidir, see ANALOG-PART[5D])

### Nets
+1V2: C40.2 C41.2 U7.2(VDD_1.2)
+3V3: C35.2 C47.2 C50.1 C51.2 C52.2 C53.2 C54.2 C55.2 C56.2 C57.2 C58.2 C59.2 C60.2 C61.2 C62.2 C63.2 C64.2 C65.2 C66.2 C67.2 C68.2 C92.2 D11.3(AC) D13.3(AC) FB1.1 FLASH1.8(VCC) H1.10 H1.12 J2.1(VCC) J3.9(LED_G_A) J3.12(LED_Y_A) R33.2 R34.2 R51.2 R52.2 R53.2 R56.2 R63.2 R64.2 R65.2 R66.2 R72.1 R73.1 SW1.1 U6.5(VCC) U8.6(VBAT) U8.15(VDD) U8.23(VDD) U8.36(VDD) U8.38(VREF+) U8.39(VDDA) U8.49(VDD) U8.62(VDD) U8.72(VDD) U8.82(VDD) U8.91(VDD) U8.103(VDD) U8.114(VDD33_USB) U8.127(VDD) U8.136(VDD) U8.149(VDD) U8.159(VDD) U8.171(PDR_ON) U8.172(VDD)
+5V: C69.1 DISP1.1(5V) R37.2
GND: C35.1 C36.1 C37.1 C38.1 C39.1 C40.1 C41.1 C42.1 C43.1 C44.1 C45.1 C46.1 C47.1 C48.1 C49.1 C50.2 C51.1 C52.1 C53.1 C54.1 C55.1 C56.1 C57.1 C58.1 C59.1 C60.1 C61.1 C62.1 C63.1 C64.1 C65.1 C66.1 C67.1 C68.1 C69.2 C70.1 C71.1 C72.1 C73.1 C74.1 C92.1 D9.1(C) DISP1.2(GND) DISP1.12(MH) DISP1.13(MH) DISP1.14(MH) DISP1.15(MH) FB3.2 FLASH1.4(GND) FLASH1.9(EP) H1.14 H1.16 J2.5(GND) R35.1 R36.1 R44.1 R45.1 R60.2 R61.2 R62.2 R74.1 RST1.1 TP5.1(Test_Point) U5.4(GND) U6.3(GND) U7.1(GND) U7.33(EP) U8.14(VSS) U8.22(VSS) U8.37(VSSA) U8.48(VSS) U8.61(VSS) U8.71(VSS) U8.90(VSS) U8.102(VSS) U8.113(VSS) U8.126(VSS) U8.135(VSS) U8.148(VSS) U8.158(VSS) U8.177(EP) USB1.A1B12(GND) USB1.B1A12(GND) X1.2 X1.4 X2.2 X2.4
RJ45_FE: FB3.1 J3.8(CGND)
V_SYS: H1.8
VBUS: C43.2 D9.2(A) FB2.1 USB1.A4B9(VBUS) USB1.B4A9(VBUS)
VDDIO: C36.2 C37.2 C38.2 C39.2 FB1.2 R50.2 R54.2 R55.2 R57.2 R58.2 R59.2 U7.3(VDDA_3.3) U7.17(VDDIO)
5V_USB: C44.2 FB2.2 R37.1 TP4.1(Test_Point)
ADC1_INP2: U8.59(PF11) ; port ADC1_INP2
BATT_LEVEL: U8.43(PH2) ; port BATT_LEVEL
CIRCUIT_NRST: C42.2 C74.2 D10.A J2.3(NRST) R33.1 RST1.2 U6.2(A) U8.31(NRST)
CONFIG0_RES: R59.1 SB6.2
DAC1_OUT1: U8.50(PA4) ; port DAC1_OUT1
DAC1_OUT2: U8.51(PA5) ; port DAC1_OUT2
DUPLEX_RES: R60.1 SB7.2
FLASH_QSPI_CLK: FLASH1.6(CLK) U8.28(PF10)
FLASH_QSPI_IO0: FLASH1.5(DI(IO0)) U8.26(PF8)
FLASH_QSPI_IO1: FLASH1.2(DO(IO1)) U8.27(PF9)
FLASH_QSPI_IO2: FLASH1.3(/WP(IO2)) U8.25(PF7)
FLASH_QSPI_IO3: FLASH1.7(/HOLD(IO3)) U8.24(PF6)
FLASH_QSPI_NCS: FLASH1.1(/CS) R56.1 U8.79(PB10)
GPIO_2W_IN_ALERT1: U8.108(PG4) ; port GPIO_2W_IN_ALERT1
GPIO_4W_IN_ALERT1: U8.109(PG5) ; port GPIO_4W_IN_ALERT1
GPIO_DIS_3W: U8.111(PG7) ; port GPIO_DIS_3W
GPIO_ERR_2W_OUT: U8.112(PG8) ; port GPIO_ERR_2W_OUT
GPIO_ERR_3W_OUT: U8.110(PG6) ; port GPIO_ERR_3W_OUT
I2C3_SCL: R72.2 U8.84(PH7) ; port I2C3_SCL
I2C3_SDA: R73.2 U8.85(PH8) ; port I2C3_SDA
I2C4_SCL: R63.1 U8.64(PF14) ; port I2C4_SCL
I2C4_SDA: R64.1 U8.65(PF15) ; port I2C4_SDA
ISO_RES: R57.1 SB4.2
KSZ_CONFIG0: SB6.1 U7.28(CONFIG0)
KSZ_CRS_DV: R42.2 U7.18(CRS_DV/CONFIG2)
KSZ_ISO: SB4.1 U7.20(RXER/ISO)
KSZ_LED0: R40.2 SB8.1 U7.30(LED0/PME_N1/NWAYEN)
KSZ_LED1: R38.2 U7.31(LED1/SPEED)
KSZ_MDC: U7.12(MDC) U8.33(PC1)
KSZ_MDIO: R34.1 U7.11(MDIO) U8.42(PA2)
KSZ_PHYAD0: SB9.1 U7.13(PHYAD0)
KSZ_PHYAD1: SB1.1 U7.14(PHYAD1)
KSZ_PME_EN: SB3.1 U7.22(PME_EN)
KSZ_REF_CLK: R43.2 SB5.1 U7.19(REF_CLK/B-CAST_OFF)
KSZ_REXT: R35.2 U7.10(REXT)
KSZ_RST: D10.K U7.32(RST#) U8.106(PG2)
KSZ_RXD0: R39.2 SB7.1 U7.16(RXD0/DUPLEX)
KSZ_RXD1: R41.2 SB2.1 U7.15(RXD1/PHYAD2)
KSZ_TXD0: R69.1 U7.24(TXD0)
KSZ_TXD1: R70.1 U7.25(TXD1)
KSZ_TXEN: R68.1 U7.23(TXEN)
LCD_BL: DISP1.9(LCD_BL) U8.118(PC9)
LCD_DC: DISP1.7(LCD_DC) U8.12(PI10)
LCD_RST: DISP1.8(LCD_RST) U8.11(PI9)
LED1.BK: D11.4(CB) R49.1
LED1.GK: D11.2(CG) R48.1
LED1.RK: D11.1(CR) R47.1
LED2.BK: D13.4(CB) R105.1
LED2.GK: D13.2(CG) R104.1
LED2.RK: D13.1(CR) R103.1
LED _GREEN: J3.10(LED_G_K) R38.1
LED _YELLOW: J3.11(LED_Y_K) R40.1
MCU_BOOT0: R74.2 SW1.2 U8.166(BOOT0)
MCU_CRS_DV: R42.1 U8.53(PA7)
MCU_LEDB_1: R49.2 U8.121(PA10)
MCU_LEDB_2: R105.2 U8.176(PI7)
MCU_LEDG_1: R48.2 U8.120(PA9)
MCU_LEDG_2: R104.2 U8.175(PI6)
MCU_LEDR_1: R47.2 U8.119(PA8)
MCU_LEDR_2: R103.2 U8.174(PI5)
MCU_OSC_IN: R71.2 U8.29(PH0-OSC_IN)
MCU_OSC_OUT: C70.2 U8.30(PH1-OSC_OUT) X2.1
MCU_REF_CLK: R43.1 U8.41(PA1)
MCU_RXD0: R39.1 U8.54(PC4)
MCU_RXD1: R41.1 U8.55(PC5)
MCU_SWCLK: J2.4(SWCLK/TCK) U8.137(PA14)
MCU_SWDIO: J2.2(SWDIO/TMS) U8.124(PA13)
MCU_SWO: J2.6(SWO/TDO) U8.161(PB3)
MCU_TXD0: R69.2 U8.92(PB12)
MCU_TXD1: R70.2 U8.93(PB13)
MCU_TXEN: R68.2 U8.80(PB11)
MCU_VCAP1: C73.2 U8.81(VCAP1)
MCU_VCAP2: C72.2 U8.125(VCAP2)
NWAYEN_RES: R61.1 SB8.2
PHY_OSC_IN: R46.2 U7.9(XI)
PHY_OSC_OUT: C48.2 U7.8(XO) X1.1
PHY_XTAL_IN: C49.2 R46.1 X1.3
PHYAD0_RES: R62.1 SB9.2
PHYAD1_RES: R50.1 SB1.2
PHYAD2_RES: R54.1 SB2.2
PME_RES: R55.1 SB3.2
REF_CLK_RES: R58.1 SB5.2
RJ_RDC: C46.2 J3.5(RDC)
RJ_RX_N: J3.6(RD-) U7.4(RXM)
RJ_RX_P: J3.3(RD+) U7.5(RXP)
RJ_TDC: C45.2 J3.4(TDC)
RJ_TX_N: J3.2(TD-) U7.6(TXM)
RJ_TX_P: J3.1(TD+) U7.7(TXP)
SPARE_ADC1: H1.1 U8.57(PB1)
SPARE_ADC2: H1.6 U8.21(PF5)
SPARE_I2C1_SCL: H1.2 R52.1 U8.164(PB6)
SPARE_I2C1_SDA: H1.4 R53.1 U8.165(PB7)
SPARE_PWM1: H1.3 U8.40(PA0-WKUP)
SPARE_SPI3_MISO: H1.11 U8.140(PC11)
SPARE_SPI3_MOSI: H1.9 U8.141(PC12)
SPARE_SPI3_NSS: H1.15 R51.1 U8.138(PA15)
SPARE_SPI3_SCK: H1.13 U8.139(PC10)
SPARE_UART4_RX: H1.7 U8.129(PH14)
SPARE_UART4_TX: H1.5 U8.128(PH13)
SPI1_CLK: R67.2 ; port SPI1_CLK
SPI1_CLK_R: R67.1 U8.154(PG11)
SPI1_CS: U8.153(PG10) ; port SPI1_CS
SPI1_MOSI: U8.151(PD7) ; port SPI1_MOSI
SPI4_CS: DISP1.6(LCD_CS) R66.1 U8.3(PE4)
SPI4_MISO: DISP1.3(MISO) U8.4(PE5)
SPI4_MOSI: DISP1.4(MOSI) U8.5(PE6)
SPI4_SCLK: DISP1.5(SCLK) R75.2
SPI4_SCLK_R: R75.1 U8.75(PE12)
TP_CS: DISP1.10(TP_CS) R65.1 U8.8(PC13)
TP_IRQ: DISP1.11(TP_IRQ) U8.7(PI8)
TRIG_LED_A: D8.A U6.4(~{Y})
TRIG_LED_K: D8.K R36.2
USB-C_MCU_CC1: R45.2 USB1.A5(CC1)
USB-C_MCU_CC2: R44.2 USB1.B5(CC2)
USB-C_MCU_D_N: U5.2(NC) U5.5(IO2) U8.122(PA11) USB1.A7(DN1) USB1.B7(DN2)
USB-C_MCU_D_P: U5.3(IO1) U8.123(PA12) USB1.A6(DP1) USB1.B6(DP2)
XTAL_IN: C71.2 R71.1 X2.3

Not connected (* = marked no-connect by the designer): J3 7(NC)*; U5 1(NC)*; U7 21(INTRP/PME_N2/NAND_TREE#)* 26(NC)* 27(NC)* 29(CONFIG1)*; U8 1(PE2)* 2(PE3)* 9(PC14-OSC32_IN)* 10(PC15-OSC32_OUT)* 13(PI11) 16(PF0)* 17(PF1)* 18(PF2)* 19(PF3)* 20(PF4)* 32(PC0)* 34(PC2_C)* 35(PC3_C)* 44(PH3)* 45(PH4)* 46(PH5)* 47(PA3)* 52(PA6)* 56(PB0)* 58(PB2)* 60(PF12)* 63(PF13)* 66(PG0)* 67(PG1)* 68(PE7)* 69(PE8)* 70(PE9)* 73(PE10)* 74(PE11)* 76(PE13)* 77(PE14)* 78(PE15)* 83(PH6)* 86(PH9)* 87(PH10)* 88(PH11)* 89(PH12)* 94(PB14)* 95(PB15)* 96(PD8)* 97(PD9)* 98(PD10)* 99(PD11)* 100(PD12)* 101(PD13)* 104(PD14)* 105(PD15)* 107(PG3)* 115(PC6)* 116(PC7)* 117(PC8) 130(PH15)* 131(PI0)* 132(PI1)* 133(PI2)* 134(PI3)* 142(PD0)* 143(PD1)* 144(PD2)* 145(PD3)* 146(PD4)* 147(PD5)* 150(PD6)* 152(PG9)* 155(PG12)* 156(PG13)* 157(PG14)* 160(PG15)* 162(PB4)* 163(PB5)* 167(PB8)* 168(PB9)* 169(PE0)* 170(PE1)* 173(PI4)*; USB1 A8(SBU1)* B8(SBU2)* SHELL*

### Layout directives
differential pair; differential pair class DIFF_USB_90Ω: USB-C_MCU_D_N, USB-C_MCU_D_P
net class RMII_50Ω: FLASH_QSPI_NCS, KSZ_PME_EN, KSZ_TXD0, KSZ_TXD1, KSZ_TXEN, MCU_CRS_DV, MCU_REF_CLK, MCU_RXD0, MCU_RXD1, MCU_TXD0, MCU_TXD1, MCU_TXEN
differential pair; differential pair class DIFF_MDI_100Ω: RJ_RX_N, RJ_RX_P, RJ_TX_N, RJ_TX_P
net class FLASH_50Ω: FLASH_QSPI_CLK, FLASH_QSPI_IO0, FLASH_QSPI_IO1, FLASH_QSPI_IO2, FLASH_QSPI_IO3, FLASH_QSPI_NCS

### Notes on the sheet
- (near J2) DNL
- NO UTILIZZATO PER RMII CON STM32
- FLASH MEMORY
- PHYAD1
- WAKE ON LAN
- PHYAD2
- ISO
- B_CAST_OFF
- RMII
- DUPLEX
- NWAYEN
- PHYAD0
- (in symbol KSZ8091RNBIA-TR) KSZ8091RNB; PHY ETH 10/100 Base-T/TX
- (in symbol RST_SWITCH) RST SWITCH
- (in symbol STM32H743IIT6) 2MB Arm Cortex-M7 480 MHz
- (in symbol Title) TITLE; DATE; REVISION; DRAWN BY; PAGE; OF
- (in symbol U262-161N-4BVC11) USB TYBE C
- (in symbol W25N01GVZEIG) NAND FLASH 1GB

### Library data of the parts
C35 C42 C47 C92 = CAP_0402: Capacitor SMD 0402 [C1525]; Manufacturer: *; Manufacturer Part Number: *; Distributor Link: *; LCSC: *; Rating: *; Dielectric: *
C36 C39 C40 = CAP_0603: Capacitor SMD 0603 [C60077]; Manufacturer: *; Manufacturer Part Number: *; Distributor Link: *; LCSC: *; Rating: *; Dielectric: *
C37 C38 C41 C45 C46 C50-C67 C74 = CAP_0603: Capacitor SMD 0603 [C14663]; Manufacturer: *; Manufacturer Part Number: *; Distributor Link: *; LCSC: *; Rating: *; Dielectric: *
C43 C44 = CAP_0603: Capacitor SMD 0603 [C23630]; Manufacturer: *; Manufacturer Part Number: *; Distributor Link: *; LCSC: *; Rating: *; Dielectric: *
C48 C49 C70 C71 = CAP_0402: Capacitor SMD 0402 [C1548]; Manufacturer: *; Manufacturer Part Number: *; Distributor Link: *; LCSC: *; Rating: *; Dielectric: *
C68 C72 C73 = CAP_0805: Capacitor SMD 0805[C15850]; Manufacturer: *; Manufacturer Part Number: *; Distributor Link: *; LCSC: *; Rating: *; Dielectric: *
C69 = CAP_0603: Capacitor SMD 0603 [C19702]; Manufacturer: *; Manufacturer Part Number: *; Distributor Link: *; LCSC: *; Rating: *; Dielectric: *
D8 = LED_0603_YELLOW: LED 0603 YELLOW SMD[C72038]
D9 = SMF6.0CA: [C2990473]
D10 = RB521S30T1G: [C145179]
D11 D13 = RGB_LED_0805: [C965848]
DISP1 = LCD 2.8 INCH TOUCH: 2.8inch Resistive Touch LCD, 320×240
FB1-FB3 = FB_0603: Ferrite Bead SMD 0603[C76892]; Manufacturer: *; Manufacturer Part Number: *; Distributor Link: *; LCSC: *
FLASH1 = W25N01GVZEIG: [C88868]
H1 = 16P 2.54mm_Female: [C30734]; Manufacturer: Ckmtw(灿科盟); Symbol: 210S-2*8P L=11.6MMGold-plated black; Device: B-2100S16P-B110; Add into BOM: yes; Pin Structure: 2x8P; Pitch: 2.54mm; LCSC Part Name: 间距:2.54mm 2x8P 直插; Supplier Part: C124389; Manufacturer Part: B-2100S16P-B110; Supplier Footprint: 插件,P=2.54mm; JLCPCB Part Class: Extended Part; Datasheet: https://atta.szlcsc.com/upload/public/pdf/source/20180130/C169817_15172974075481323419.pdf; Supplier: LCSC; Convert to PCB: yes; Row Spacing: 2.54mm; Circluar Pins/Square Pins: -; Mounting Type: Straight; Number of Rows: 双排; Number of Pins: 16P; Current Rating (Max): -; Voltage Rating (Max): -; Length of Mating Pin: 6mm; Insulation Height: 2.54mm; Length of End Connection Pin: 3mm; Contact Plating: -; Operating Temperature Range: -40℃~+105℃; Color: Black
J2 = TC2030: Tag-Connect No-Solder SWD Debug Connector DO NOT PLACE; Manufacturer: Tag-Connect; Manufacturer Part Number: TC2030
J3 = HR911105A: Single Port RJ45 Connector w/ Integrated Magnetic and LED 10/100 Base-T [C12074]; Manufacturer: HanRun; Manufacturer Part Number: HR911105A
R33 = RES_0402: Resistor SMD 0402 [C25744]; Manufacturer: *; Manufacturer Part Number: *; Distributor Link: *; LCSC: *
R34 = RES_0603: Resistor SMD 0603[C21190]; Manufacturer: *; Manufacturer Part Number: *; Distributor Link: *; LCSC: *
R35 = RES_0603: Resistor SMD 0603 [C269508]; Manufacturer: *; Manufacturer Part Number: *; Distributor Link: *; LCSC: *
R36 = RES_0402: Resistor SMD 0402 [C11702]; Manufacturer: *; Manufacturer Part Number: *; Distributor Link: *; LCSC: *
R37 = RES_0603: [C21189]; Manufacturer: *; Manufacturer Part Number: *; Distributor Link: *; LCSC: *
R38 R40 = RES_0603: Resistor SMD 0603 [C22962]; Manufacturer: *; Manufacturer Part Number: *; Distributor Link: *; LCSC: *
R39 R41-R43 R67-R70 R75 = RES_0402: Resistor SMD 0402 [C25092]; Manufacturer: *; Manufacturer Part Number: *; Distributor Link: *; LCSC: *
R44 R45 = RES_0603: [C23186]; Manufacturer: *; Manufacturer Part Number: *; Distributor Link: *; LCSC: *
R46 R71 = RES_0402: Resistor SMD 0402 [C17168]; Manufacturer: *; Manufacturer Part Number: *; Distributor Link: *; LCSC: *
R47 R103 = RES_0603: [C22828]; Manufacturer: *; Manufacturer Part Number: *; Distributor Link: *; LCSC: *
R48 R49 R104 R105 = RES_0603: [C4275]; Manufacturer: *; Manufacturer Part Number: *; Distributor Link: *; LCSC: *
R50 R54 R55 R57-R59 = RES_0603: Resistor SMD 0603 [C116693]; Manufacturer: *; Manufacturer Part Number: *; Distributor Link: *; LCSC: *
R51 R56 R65 R66 = RES_0603: [C25804]; Manufacturer: *; Manufacturer Part Number: *; Distributor Link: *; LCSC: *
R52 R53 R63 R64 R72 R73 = RES_0603: [C105428]; Manufacturer: *; Manufacturer Part Number: *; Distributor Link: *; LCSC: *
R60-R62 = RES_0603: Resistor SMD 0603 [C103198]; Manufacturer: *; Manufacturer Part Number: *; Distributor Link: *; LCSC: *
R74 = RES_0603: Resistor SMD 0603[C25804]; Manufacturer: *; Manufacturer Part Number: *; Distributor Link: *; LCSC: *
RST1 = RST_SWITCH: [C720477]
SW1 = TS-1088-AR02016: [C720477]; Manufacturer: XUNPU(讯普); Add into BOM: yes; Circuit: SPST; Actuator Style: Round Button; Operating Force: 160gf; Switch Length: 4mm; Switch Width: 3mm; Switch Height: 2mm; Strike Gundam: 不带; Contact Current: 50mA; Voltage Rating (DC): 12V; Insulation Resistance: 100MΩ; Actuator/Cap Color: Black; Pin Style: SMDSplicing; Mechanical Life: 10万次; Symbol: TS-1088-AR02016; Device: TS-1088-AR02016; Supplier: LCSC; Supplier Part: C720477; Manufacturer Part: TS-1088-AR02016; JLCPCB Part Class: Extended Part; LCSC Part Name: 4*3*2mm 立贴 轻触开关; Supplier Footprint: SMD; Datasheet: https://atta.szlcsc.com/upload/public/pdf/source/20200810/C720475_60D09DD6C54279ADDB2DC25100F1CC11.pdf; Convert to PCB: yes; Mounting Style: Brick nogging; Operating Temperature: -30℃~+80℃
U5 = CMP-04985-000005-1: TVS DIODE 5.5V 12.4V SOT5[C1855726]; Manufacturer: Texas Instruments; Standoff Height: 0mm; Interface: USB,Ethernet,LVDS,Other; Peak Pulse Current: 5.5A; Number Of Channels: 2; Clamping Voltage: 9.7V; Peak Pulse Power: 85W; Breakdown Voltage: 6.5V; Direction: Unidirectional; Digikey Description: TVS DIODE 5.5V 12.4V SOT5; Footprint Url: http://www.ti.com/lit/ds/symlink/sn74ahct1g08.pdf; ComponentLink2URL: http://www.ti.com/lit/ds/symlink/tpd2e2u06.pdf; Ambient Temperature Range Low: -40°C; Temperature: -40°C to +125°C; Temperature Range Low: -40°C; Lead Free: Yes; Automotive: No; Octopart: https://octopart.com/tpd2e2u06drlr-texas+instruments-47095345; Ambient Temperature Range High: +125°C; Height: 0.6mm; RoHS: TRUE; Category: IC; Package: DRL0005A; Device Class L1: Circuit Protection; Temperature Range High: +125°C; Manufacturer Part Number: TPD2E2U06DRLR; Device Class L2: ESD and Circuit Protection ICs; Ipc Land Pattern Name: SOTFL50P160X55-6; ComponentLink2Description: Datasheet; Mouser Description: ESD Suppressors Dual-Ch High-Speed ESD Protection; Reverse Standoff Voltage: 5.5V; Device Class L3: unset
U6 = 74LVC1G14GW,125: Inverter Schmitt Trigger 1-Element CMOS 5-Pin TSSOP T/R; Price: None; Availability: Unavailable; MP: 74LVC1G14GW,125; Value: *; Package: None
U7 = KSZ8091RNBIA-TR: [C631649]
U8 = STM32H743IIT6: [C89597]; Manufacturer: STMicroelectronics; Manufacturer Part Number: STM32H743IIT6; Distributor Link 1: https://www.mouser.com/ProductDetail/STMicroelectronics/STM32H743IIT6?qs=FNcb6ahWXRzE163cq8Rfjg%3D%3D; Distributor Link 2: https://www.digikey.com/en/products/detail/stmicroelectronics/STM32H743IIT6/7915904?s=N4IgTCBcDaIMoBUCyBmMAJA7AFhQSTwQDYQBdAXyA; Mounting Type: SMD; ComponentLink1Description: Datasheet; ComponentLink1URL: https://www.mouser.com/datasheet/2/389/stm32h743vi-1760857.pdf; LCSC: C89597; Supplier 1: Mouser; Supplier Part Number 1: 511-STM32H743IIT6; Supplier 2: Digi-Key; Supplier Part Number 2: 497-17722-ND
USB1 = U262-161N-4BVC11: [C319148]; Manufacturer: XKB Connectivity(中国星坤); Symbol: U262-16XN-4BVC11; Add into BOM: yes; Connector Type: Type-C; Gender: Female; Number of Ports: 1; Number of Contacts: 16P; Current Rating - Power (Max): 3A; Soldering Temperature(Max): 260℃; Device: U262-161N-4BVC11; LCSC Part Name: Type-C 母 卧贴; Supplier Part: C319148; Manufacturer Part: U262-161N-4BVC11; Supplier Footprint: SMD; JLCPCB Part Class: Extended Part; Datasheet: https://atta.szlcsc.com/upload/public/pdf/source/20211015/B478CBA0F1623DA36A6CC6918C49C838.pdf; Supplier: LCSC; Convert to PCB: yes; Standard: USB 3.1; Mounting Style: 卧贴; Contact Material: Copper Alloy; Contact Plating: Gold; Operating Temperature Range: -40℃~+85℃
X1 X2 = TSX-3225_24.0000MF15X-AC: Crystal SMD 24MHz 10PPM 7pF 3225 [C9006]; Manufacturer: Epson; Manufacturer Part Number: TSX-3225 24.0000MF15X-AC
SB1-SB9 = Solderbridge: Value: Solderbridge
TP4 TP5 = Test Point: Value: Test Point

## Sheet ANALOG-PART.SchDoc: ANALOG SIGNAL DEV-BOARD
size A2; DrawnBy: Luca Schenetti; Revision: V1.0; SheetNumber: 4; SheetTotal: 4
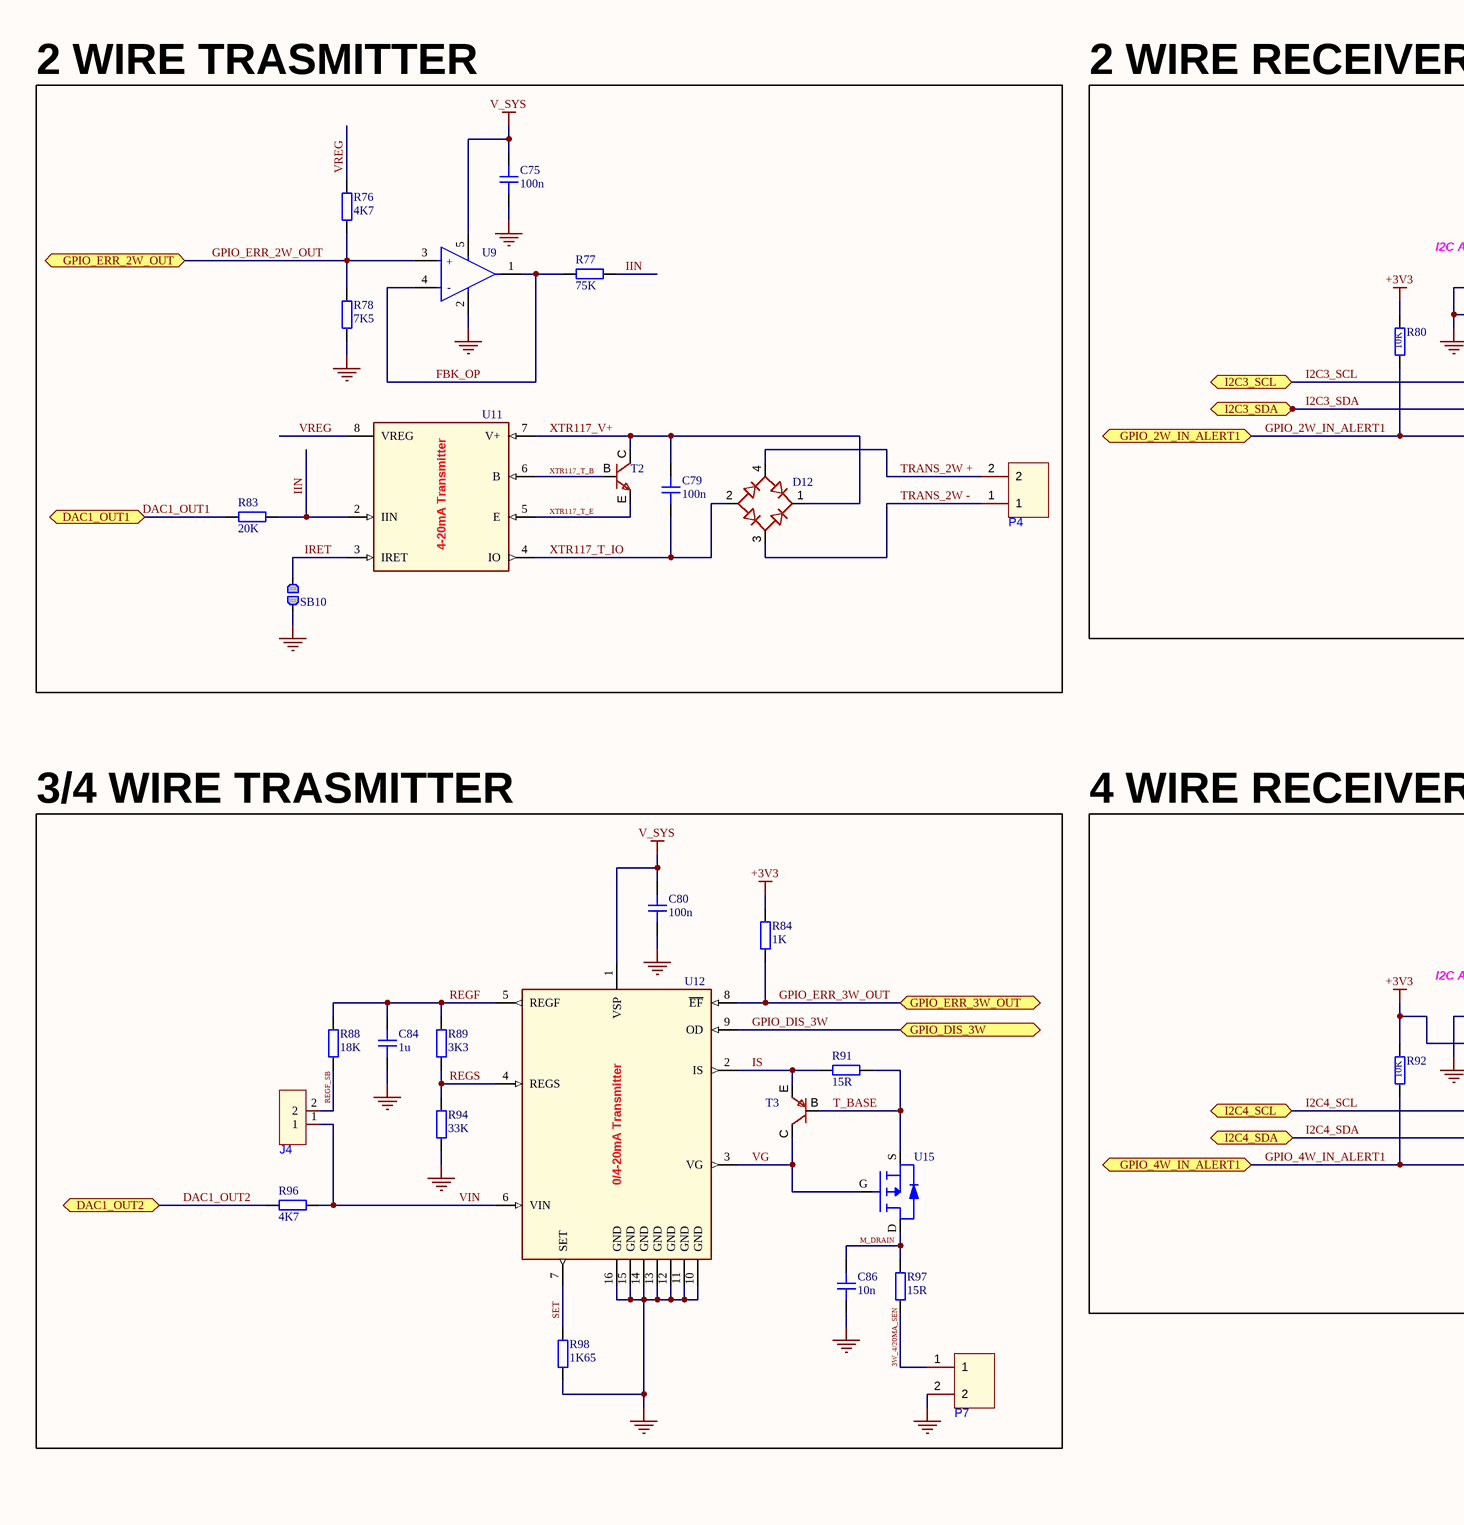
[diagram p8: ANALOG-PART.SchDoc, left]
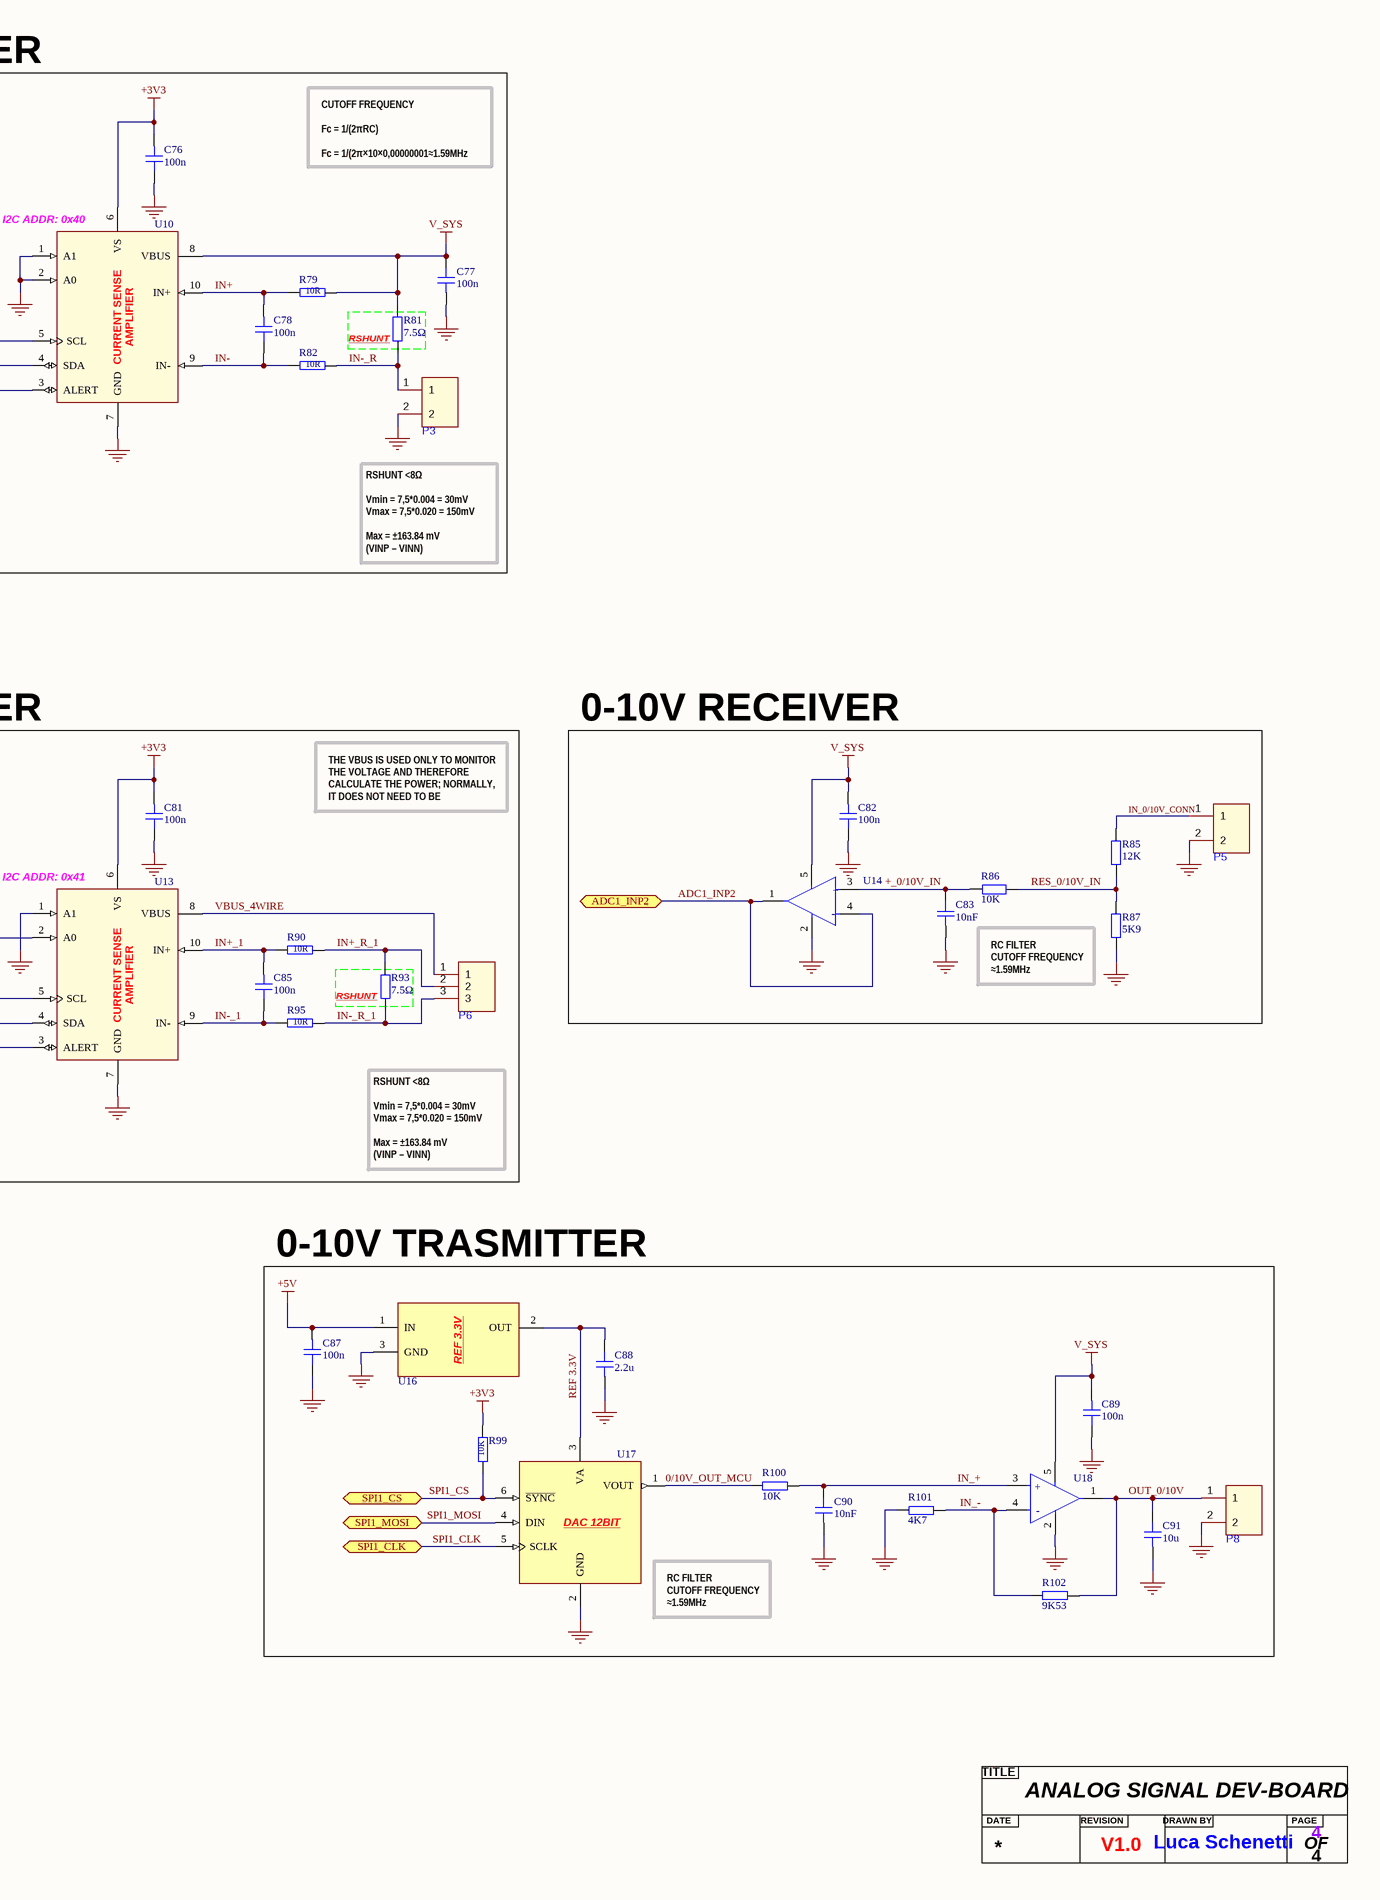
[diagram p9: ANALOG-PART.SchDoc, right]

### Parts
(Parts that share a designator on the sheet are numbered #1, #2 ... from top to bottom, then left to right.)
?#4  Title  (value not drawn)  (graphical)
C75  100n  [CAP_0603]
C76  100n  [CAP_0603]
C77  100n  [CAP_0603]
C78  100n  [CAP_0603]
C79  100n  [CAP_0603]
C80  100n  [CAP_0603]
C81  100n  [CAP_0603]
C82  100n  [CAP_0603]
C83  10nF  [CAP_0603]
C84  1u  [CAP_0603]
C85  100n  [CAP_0603]
C86  10n  [CAP_0603]
C87  100n  [CAP_0603]
C88  2.2u  [CAP_0603]
C89  100n  [CAP_0603]
C90  10nF  [CAP_0603]
C91  10u  [CAP_0603]
D12  MBS Bridge Rectifiers 35A 1.1V  [MB10S]  (value not drawn)
J4  2.54mm 2P  [2.54mm 2P]  (value not drawn)
P3  WJ500V-5.08-2P  [CONN-TH_2P-P5.00_WJ500V-5.08-2P]  (value not drawn)
P4  WJ500V-5.08-2P  [CONN-TH_2P-P5.00_WJ500V-5.08-2P]  (value not drawn)
P5  WJ500V-5.08-2P  [CONN-TH_2P-P5.00_WJ500V-5.08-2P]  (value not drawn)
P6  WJ500V-5.08-3P  [CONN-TH_3P-P5.00_WJ500V-5.08-3P]  (value not drawn)
P7  WJ500V-5.08-2P  [CONN-TH_2P-P5.00_WJ500V-5.08-2P]  (value not drawn)
P8  WJ500V-5.08-2P  [CONN-TH_2P-P5.00_WJ500V-5.08-2P]  (value not drawn)
R76  4K7  [RES_0603]
R77  75K  [RES_0603]
R78  7K5  [RES_0603]
R79  10R  [RES_0603]
R80  10K  [RES_0603]
R81  7.5Ω  [RES_0805]
R82  10R  [RES_0603]
R83  20K  [RES_0603]
R84  1K  [RES_0603]
R85  12K  [RES_0603]
R86  10K  [RES_0603]
R87  5K9  [RES_0603]
R88  18K  [RES_0603]
R89  3K3  [RES_0603]
R90  10R  [RES_0603]
R91  15R  [RES_0603]
R92  10K  [RES_0603]
R93  7.5Ω  [RES_0805]
R94  33K  [RES_0603]
R95  10R  [RES_0603]
R96  4K7  [RES_0603]
R97  15R  [RES_0603]
R98  1K65  [RES_0603]
R99  10K  [RES_0603]
R100  10K  [RES_0603]
R101  4K7  [RES_0603]
R102  9K53  [RES_0603]
SB10  Solderbridge  [Solderbridge]  (value not drawn)  (no BOM)
T2  45V NPN IC = 2A  [FCX690BTA]  (value not drawn)
T3  25V PNP IC = 1,5A  [SS8550]  (value not drawn)
U9  OPA197IDBVR  [FP-DBV0005A-IPC_A]  (value not drawn)
U10  Current Sense Amplifiers  [INA237AIDGSR]  (value not drawn)
U11  4-20mA Current Loop Transmitter  [XTR117AIDGKR]  (value not drawn)
U12  0/4-20mA Current Loop Transmitter  [XTR111AIDGQR]  (value not drawn)
U13  Current Sense Amplifiers  [INA237AIDGSR]  (value not drawn)
U14  OPA197IDBVR  [FP-DBV0005A-IPC_A]  (value not drawn)
U15  P-Channel Mosfet Vds=-60V Vgs=-20V  [SI2309CDS-T1-GE3]  (value not drawn)
U16  REF 3.3V  [REF3033AIDBZR]  (value not drawn)
U17  DAC 12BIT  [DAC121S101CIMK/NOPB]  (value not drawn)
U18  OPA197IDBVR  [FP-DBV0005A-IPC_A]  (value not drawn)

### Blocks framed on the sheet
2 WIRE TRASMITTER: C75 C79 D12 P4 R76-R78 R83 SB10 T2 U9 U11
2 WIRE RECEIVER: C76-C78 P3 R79 R80 R82 U10
RSHUNT: R81
4 WIRE RECEIVER: C81 C85 P6 R90 R92 R95 U13
0-10V RECEIVER: C82 C83 P5 R85-R87 U14
RSHUNT: R93
0-10V TRASMITTER: C87-C91 P8 R99-R102 U16-U18

### Ports
ADC1_INP2 (bidir, see STM32-MCU[3B]), DAC1_OUT1 (bidir, see STM32-MCU[1B]), DAC1_OUT2 (bidir, see STM32-MCU[1B]), GPIO_2W_IN_ALERT1 (bidir, see STM32-MCU[4C]), GPIO_4W_IN_ALERT1 (bidir, see STM32-MCU[4C]), GPIO_DIS_3W (bidir, see STM32-MCU[4C]), GPIO_ERR_2W_OUT (bidir, see STM32-MCU[4C]), GPIO_ERR_3W_OUT (bidir, see STM32-MCU[4C]), I2C3_SCL (bidir, see STM32-MCU[4C]), I2C3_SDA (bidir, see STM32-MCU[4C]), I2C4_SCL (bidir, see STM32-MCU[4B]), I2C4_SDA (bidir, see STM32-MCU[4B]), SPI1_CLK (bidir, see STM32-MCU[4C]), SPI1_CS (bidir, see STM32-MCU[3C]), SPI1_MOSI (bidir, see STM32-MCU[1C])

### Nets
+3V3: C76.1 C81.1 R80.2 R84.2 R92.2 R99.2 U10.6(VS) U13.2(A0) U13.6(VS)
+5V: C87.1 U16.1(IN)
GND: C75.2 C76.2 C77.1 C80.2 C81.2 C82.2 C83.1 C84.2 C86.2 C87.2 C88.1 C89.2 C90.1 C91.1 P3.2 P5.2 P7.2 P8.2 R78.1 R87.1 R94.2 R98.1 R101.1 SB10.1 U9.2(V-) U10.1(A1) U10.2(A0) U10.7(GND) U12.10(GND) U12.11(GND) U12.12(GND) U12.13(GND) U12.14(GND) U12.15(GND) U12.16(GND) U13.1(A1) U13.7(GND) U14.2(V-) U16.3(GND) U17.2(GND) U18.2(V-)
V_SYS: C75.1 C77.2 C80.1 C82.1 C89.1 R79.2 R81.2 U9.5(V+) U10.8(VBUS) U12.1(VSP) U14.5(V+) U18.5(V+)
0/10V_OUT_MCU: R100.1 U17.1(VOUT)
3W_4/20MA_SEN: P7.1 R97.1
+_0/10V_IN: C83.2 R86.2 U14.3(+IN)
ADC1_INP2: U14.1(OUT) U14.4(-IN) ; port ADC1_INP2
DAC1_OUT1: R83.1 ; port DAC1_OUT1
DAC1_OUT2: R96.1 ; port DAC1_OUT2
FBK_OP: R77.1 U9.1(OUT) U9.4(-IN)
GPIO_2W_IN_ALERT1: R80.1 U10.3(ALERT) ; port GPIO_2W_IN_ALERT1
GPIO_4W_IN_ALERT1: R92.1 U13.3(ALERT) ; port GPIO_4W_IN_ALERT1
GPIO_DIS_3W: U12.9(OD) ; port GPIO_DIS_3W
GPIO_ERR_2W_OUT: R76.1 R78.2 U9.3(+IN) ; port GPIO_ERR_2W_OUT
GPIO_ERR_3W_OUT: R84.1 U12.8(~{EF}) ; port GPIO_ERR_3W_OUT
I2C3_SCL: U10.5(SCL) ; port I2C3_SCL
I2C3_SDA: U10.4(SDA) ; port I2C3_SDA
I2C4_SCL: U13.5(SCL) ; port I2C4_SCL
I2C4_SDA: U13.4(SDA) ; port I2C4_SDA
IIN: R77.2 R83.2 U11.2(IIN)
IN+: C78.1 R79.1 U10.10(IN+)
IN+_1: C85.1 R90.1 U13.10(IN+)
IN+_R_1: P6.2 R90.2 R93.2
IN-: C78.2 R82.1 U10.9(IN-)
IN-_1: C85.2 R95.1 U13.9(IN-)
IN-_R: P3.1 R81.1 R82.2
IN-_R_1: P6.3 R93.1 R95.2
IN_0/10V_CONN: P5.1 R85.2
IN_+: C90.2 R100.2 U18.3(+IN)
IN_-: R101.2 R102.1 U18.4(-IN)
IRET: SB10.2 U11.3(IRET)
IS: R91.1 T3.E U12.2(IS)
M_DRAIN: C86.1 R97.2 U15.D
OUT_0/10V: C91.2 P8.1 R102.2 U18.1(OUT)
REF 3.3V: C88.2 U16.2(OUT) U17.3(VA)
REGF: C84.1 R88.2 R89.2 U12.5(REGF)
REGF_SB: J4.2 R88.1
REGS: R89.1 R94.1 U12.4(REGS)
RES_0/10V_IN: R85.1 R86.1 R87.2
SET: R98.2 U12.7(SET)
SPI1_CLK: U17.5(SCLK) ; port SPI1_CLK
SPI1_CS: R99.1 U17.6(~{SYNC}) ; port SPI1_CS
SPI1_MOSI: U17.4(DIN) ; port SPI1_MOSI
T_BASE: R91.2 T3.B U15.S
TRANS_2W +: D12.4(AC1) P4.2
TRANS_2W -: D12.3(AC2) P4.1
VBUS_4WIRE: P6.1 U13.8(VBUS)
VG: T3.C U12.3(VG) U15.G
VIN: J4.1 R96.2 U12.6(VIN)
VREG: R76.2 U11.8(VREG)
XTR117_T_B: T2.B U11.6(B)
XTR117_T_E: T2.E U11.5(E)
XTR117_T_IO: C79.2 D12.2(NEG) U11.4(IO)
XTR117_V+: C79.1 D12.1(POS) T2.C U11.7(V+)

### Notes on the sheet
- CUTOFF FREQUENCY
  Fc = 1/(2πRC)
  Fc = 1/(2π×10×0,00000001≈1.59MHz
- (near U10) I2C ADDR: 0x40
- RSHUNT <8Ω
  Vmin = 7,5*0.004 = 30mV
  Vmax = 7,5*0.020 = 150mV
  Max = ±163.84 mV
  (VINP – VINN)
- 3/4 WIRE TRASMITTER
- THE VBUS IS USED ONLY TO MONITOR THE VOLTAGE AND THEREFORE CALCULATE THE POWER; NORMALLY, IT DOES NOT NEED TO BE CONNECTED.
- (near U13) I2C ADDR: 0x41
- INTERNAL PULL-UP
  CONNECT GND TO DISABLE
- (near R87) RC FILTER
  CUTOFF FREQUENCY
  ≈1.59MHz
- (near U17) RC FILTER
  CUTOFF FREQUENCY
  ≈1.59MHz
- (in symbol CMP-04895-000204-1) +; -
- (in symbol INA237AIDGSR) CURRENT SENSE; AMPLIFIER
- (in symbol Title) TITLE; DATE; REVISION; DRAWN BY; PAGE; OF
- (in symbol XTR111AIDGQR) 0/4-20mA Transmitter
- (in symbol XTR117AIDGKR) 4-20mA Transmitter

### Library data of the parts
C75-C82 C85 C87 C89 = CAP_0603: Capacitor SMD 0603 [C14663]; Manufacturer: *; Manufacturer Part Number: *; Distributor Link: *; LCSC: *; Rating: *; Dielectric: *
C83 C86 C90 = CAP_0603: [C302009]; Manufacturer: *; Manufacturer Part Number: *; Distributor Link: *; LCSC: *; Rating: *; Dielectric: *
C84 = CAP_0603: [C15849]; Manufacturer: *; Manufacturer Part Number: *; Distributor Link: *; LCSC: *; Rating: *; Dielectric: *
C88 = CAP_0603: Capacitor SMD 0603 [C23630]; Manufacturer: *; Manufacturer Part Number: *; Distributor Link: *; LCSC: *; Rating: *; Dielectric: *
C91 = CAP_0603: [C96446]; Manufacturer: *; Manufacturer Part Number: *; Distributor Link: *; LCSC: *; Rating: *; Dielectric: *
D12 = MB10S: [C2488]
J4 = 2.54mm 2P: [C124375]; Manufacturer: Ckmtw(灿科盟); Symbol: 210S-1*2P L=11.6MMGold-plated black; Device: B-2100S02P-A110; Add into BOM: yes; Pin Structure: 1x2P; LCSC Part Name: 间距:2.54mm 1x2P 直插; Supplier Part: C124375; Manufacturer Part: B-2100S02P-A110; Supplier Footprint: 插件,P=2.54mm; JLCPCB Part Class: Extended Part; Datasheet: https://atta.szlcsc.com/upload/public/pdf/source/20221019/2EE72DAC61CAA62C0A53546E211F9C15.pdf; Supplier: LCSC; Convert to PCB: yes; Pitch: 2.54mm; Row Spacing: -; Circluar Pins/Square Pins: -; Mounting Type: Straight; Number of Rows: Plugin; Number of Pins: 2P; Current Rating (Max): -; Voltage Rating (Max): -; Length of Mating Pin: 6mm; Insulation Height: 2.54mm; Length of End Connection Pin: 3mm; Contact Plating: -; Operating Temperature Range: -40℃~+105℃; Color: Black
P3-P5 P7 P8 = WJ500V-5.08-2P: as P1 on sheet PWR-RAIL; Device: WJ500V-5.08-2P; LCSC Part Name: 1x2P 5.08mm 直插 排数:1 每排P数:2; Supplier Part: C8465; Manufacturer Part: WJ500V-5.08-2P; Supplier Footprint: 插件,P=5.08mm; JLCPCB Part Class: Extended Part; Datasheet: https://atta.szlcsc.com/upload/public/pdf/source/20191225/C8465_02D34CE5B5B4A53DF5891601D97FA9F4.pdf; Supplier: LCSC; Convert to PCB: yes; Color: Green; Mounting Style: Straight; Number of Pins: 2P; Number of Rows: 1; Contact Material: -; Contact Plating: -; Operating Temperature Range: -40℃~+105℃; Soldering Temperature(Max): -
P6 = WJ500V-5.08-3P: [C72334]; Manufacturer: KANGNEX(康奈克斯电气); Symbol: WJ500V-5.08-3P-14-00A; Add into BOM: yes; Structure: 1x3P; Pitch: 5.08mm; Current Rating (Max): 18A; Voltage Rating (Max): 250V; Wire Gauge - AWG: 14~30; Wire Gauge - mm2: 2.5; Number of PINs Per Row: 3; Device: WJ500V-5.08-3P; LCSC Part Name: 5.08mm 1x3P 排数:1 每排P数:3 直插; Supplier Part: C72334; Manufacturer Part: WJ500V-5.08-3P; Supplier Footprint: 插件,P=5.08mm; JLCPCB Part Class: Extended Part; Datasheet: https://atta.szlcsc.com/upload/public/pdf/source/20191225/C72334_8A5EF831D67650233B6B1E3F2BC06274.pdf; Supplier: LCSC; Convert to PCB: yes; Color: Green; Mounting Style: Straight; Number of Pins: 3P; Number of Rows: 1; Operating Temperature Range: -40℃~+105℃
R76 R101 = RES_0603: [C105428]; Manufacturer: *; Manufacturer Part Number: *; Distributor Link: *; LCSC: *
R77 = RES_0603: [C23242]; Manufacturer: *; Manufacturer Part Number: *; Distributor Link: *; LCSC: *
R78 = RES_0603: [C23234]; Manufacturer: *; Manufacturer Part Number: *; Distributor Link: *; LCSC: *
R79 R82 R90 R95 = RES_0603: Resistor SMD 0603 [C22859]; Manufacturer: *; Manufacturer Part Number: *; Distributor Link: *; LCSC: *
R80 R86 R92 R99 R100 = RES_0603: [C25804]; Manufacturer: *; Manufacturer Part Number: *; Distributor Link: *; LCSC: *
R81 R93 = RES_0805: [C2828733]; Manufacturer: *; Manufacturer Part Number: *; Distributor Link: *; LCSC: *
R83 = RES_0603: [C4184]; Manufacturer: *; Manufacturer Part Number: *; Distributor Link: *; LCSC: *
R84 = RES_0603: [C21190]; Manufacturer: *; Manufacturer Part Number: *; Distributor Link: *; LCSC: *
R85 = RES_0603: [C326735]; Manufacturer: *; Manufacturer Part Number: *; Distributor Link: *; LCSC: *
R87 = RES_0603: [C491142]; Manufacturer: *; Manufacturer Part Number: *; Distributor Link: *; LCSC: *
R88 = RES_0603: [C309650]; Manufacturer: *; Manufacturer Part Number: *; Distributor Link: *; LCSC: *
R89 = RES_0603: [C22978]; Manufacturer: *; Manufacturer Part Number: *; Distributor Link: *; LCSC: *
R91 R97 = RES_0603: [C22810]; Manufacturer: *; Manufacturer Part Number: *; Distributor Link: *; LCSC: *
R94 = RES_0603: [C4216]; Manufacturer: *; Manufacturer Part Number: *; Distributor Link: *; LCSC: *
R96 = RES_0603: [C99782]; Manufacturer: *; Manufacturer Part Number: *; Distributor Link: *; LCSC: *
R98 = RES_0603: [C22845]; Manufacturer: *; Manufacturer Part Number: *; Distributor Link: *; LCSC: *
R102 = RES_0603: [C2960722]; Manufacturer: *; Manufacturer Part Number: *; Distributor Link: *; LCSC: *
T2 = FCX690BTA: [C460072]
T3 = SS8550: [C7420371]
U9 = CMP-04895-000204-1: IC OPAMP GP 1 CIRCUIT SOT23-5 [C221351]; Number of Circuits: 1; Operating Supply Current: 1mA; Input Offset Voltage (Vos): 25uV; Slew Rate: 20V/µs; Output Current per Channel: 65mA; Input Bias Current: 5pA; Gain Bandwidth Product: 10MHz; RoHS Compliant: Yes; Max Operating Temperature: 125°C; Packaging: Tape and Reel; Number of Channels: 1; Min Operating Temperature: -40°C; Lead Free: Lead Free; Case/Package: SOT-23-5; Mount: Surface Mount
U10 U13 = INA237AIDGSR: [C2864837]
U11 = XTR117AIDGKR: [C140927]
U12 = XTR111AIDGQR: [C26350]
U14 U18 = CMP-04895-000204-1: [C221351]; Number of Circuits: 1; Operating Supply Current: 1mA; Input Offset Voltage (Vos): 25uV; Slew Rate: 20V/µs; Output Current per Channel: 65mA; Input Bias Current: 5pA; Gain Bandwidth Product: 10MHz; RoHS Compliant: Yes; Max Operating Temperature: 125°C; Packaging: Tape and Reel; Number of Channels: 1; Min Operating Temperature: -40°C; Lead Free: Lead Free; Case/Package: SOT-23-5; Mount: Surface Mount
U15 = SI2309CDS-T1-GE3: [C5350873]
U16 = REF3033AIDBZR: [C36658]
U17 = DAC121S101CIMK/NOPB: [C81724]
SB10 = Solderbridge: Value: Solderbridge

## Nets that join several sheets
+1V2: PWR-RAIL (C34.2 R28.2 TP3.1 U4.2), STM32-MCU (C40.2 C41.2 U7.2)
+3V3: PWR-RAIL (8 pins), STM32-MCU (64 pins), ANALOG-PART (9 pins)
+5V: PWR-RAIL (8 pins), STM32-MCU (C69.1 DISP1.1 R37.2), ANALOG-PART (C87.1 U16.1)
GND: PWR-RAIL (45 pins), STM32-MCU (87 pins), ANALOG-PART (41 pins)
V_SYS: PWR-RAIL (16 pins), STM32-MCU (H1.8), ANALOG-PART (12 pins)
ADC1_INP2: STM32-MCU (U8.59), ANALOG-PART (U14.1 U14.4)
BATT_LEVEL: PWR-RAIL (J1.2 U1.12), STM32-MCU (U8.43)
DAC1_OUT1: STM32-MCU (U8.50), ANALOG-PART (R83.1)
DAC1_OUT2: STM32-MCU (U8.51), ANALOG-PART (R96.1)
GPIO_2W_IN_ALERT1: STM32-MCU (U8.108), ANALOG-PART (R80.1 U10.3)
GPIO_4W_IN_ALERT1: STM32-MCU (U8.109), ANALOG-PART (R92.1 U13.3)
GPIO_DIS_3W: STM32-MCU (U8.111), ANALOG-PART (U12.9)
GPIO_ERR_2W_OUT: STM32-MCU (U8.112), ANALOG-PART (R76.1 R78.2 U9.3)
GPIO_ERR_3W_OUT: STM32-MCU (U8.110), ANALOG-PART (R84.1 U12.8)
I2C3_SCL: STM32-MCU (R72.2 U8.84), ANALOG-PART (U10.5)
I2C3_SDA: STM32-MCU (R73.2 U8.85), ANALOG-PART (U10.4)
I2C4_SCL: STM32-MCU (R63.1 U8.64), ANALOG-PART (U13.5)
I2C4_SDA: STM32-MCU (R64.1 U8.65), ANALOG-PART (U13.4)
SPI1_CLK: STM32-MCU (R67.2), ANALOG-PART (U17.5)
SPI1_CS: STM32-MCU (U8.153), ANALOG-PART (R99.1 U17.6)
SPI1_MOSI: STM32-MCU (U8.151), ANALOG-PART (U17.4)